# EAGLE design mainboard_v03 (EAGLE 6.3)

## Sheet 1 of 6
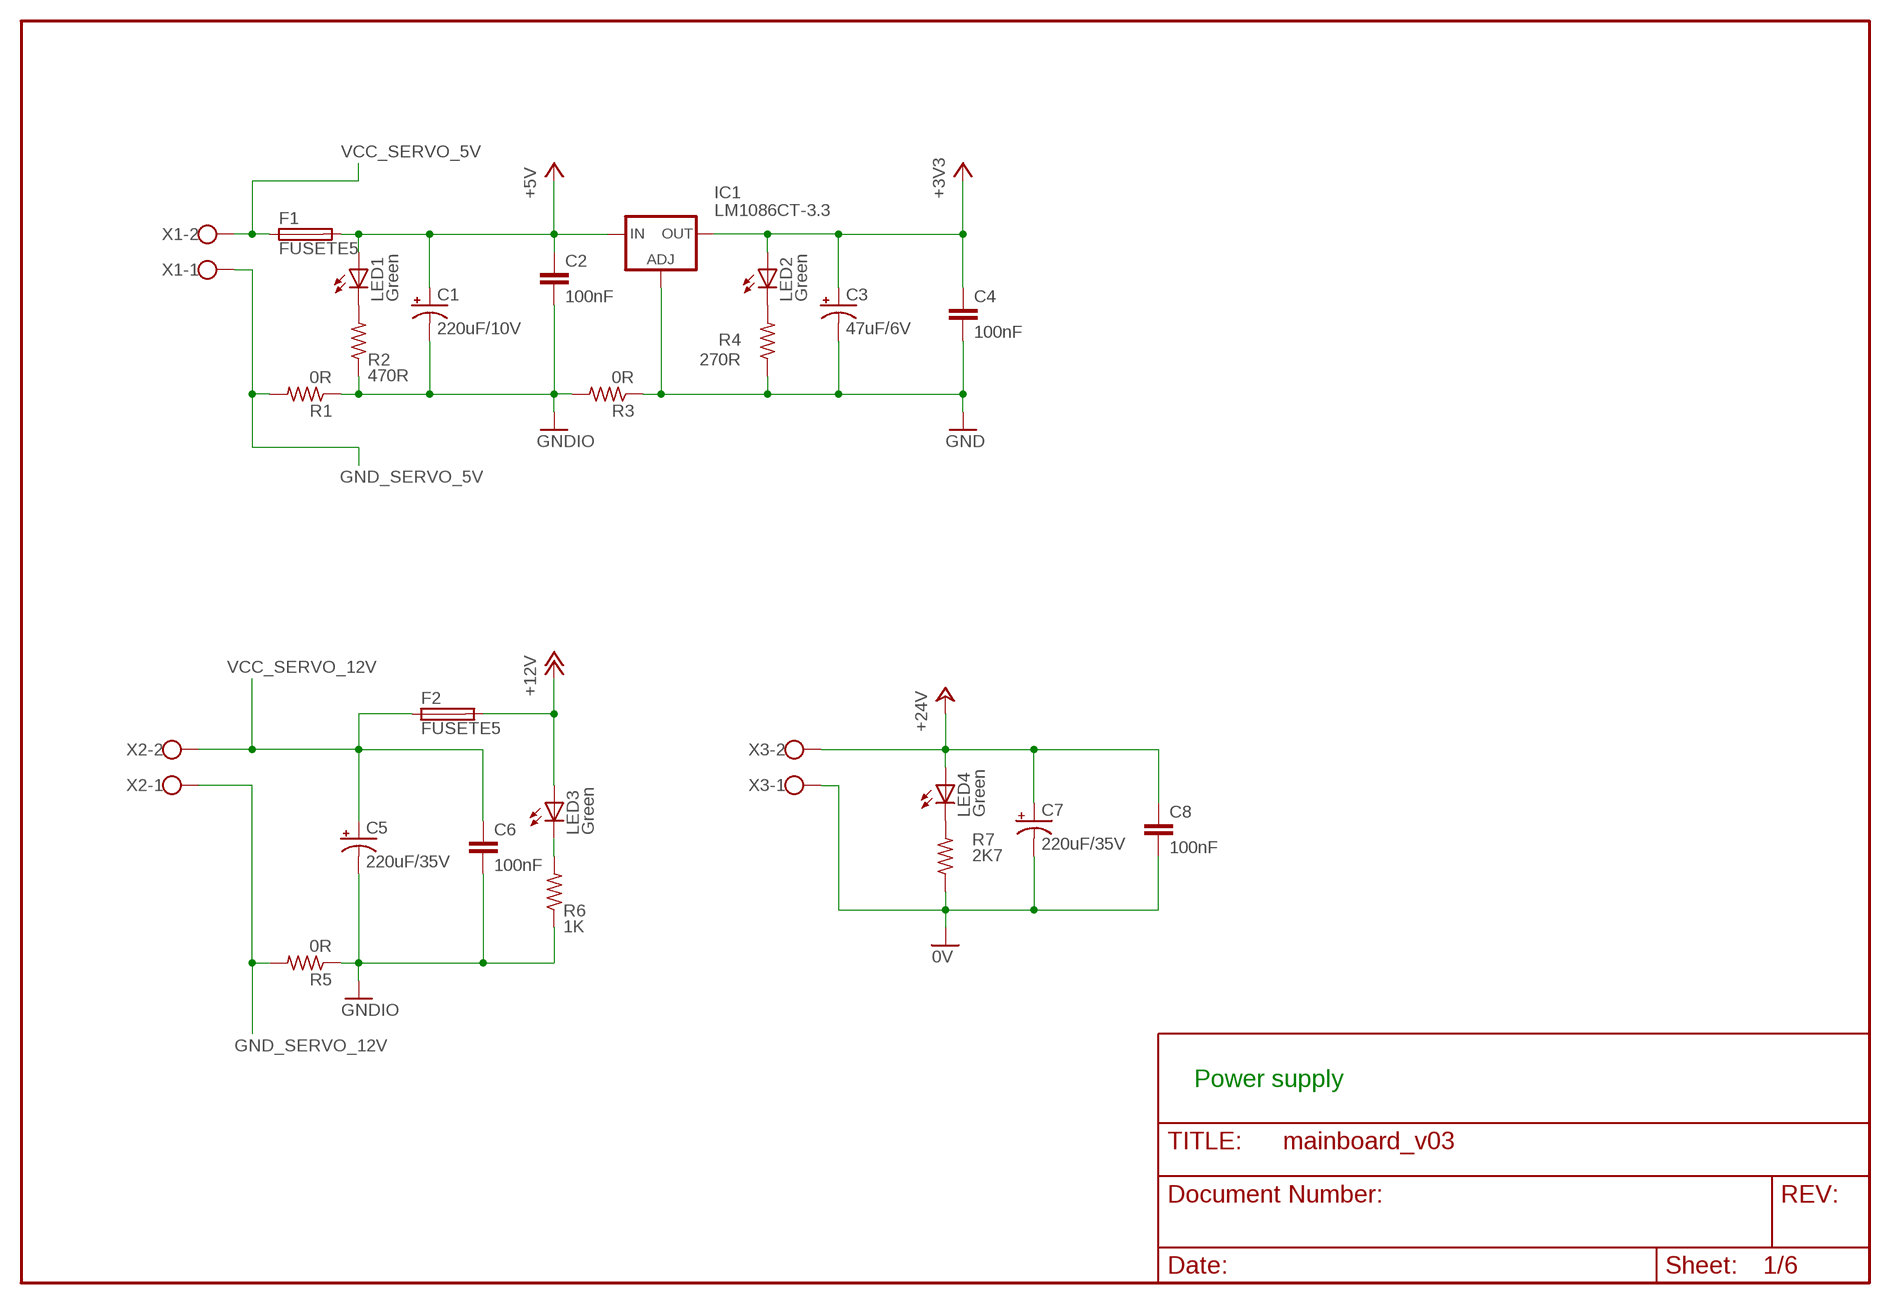
[diagram p0: schematic, sheet 1]

### Parts
C1  220uF/10V  CPOL-USE2.5-7  [E2,5-7]
C2  100nF  C-EUC0805  [C0805]
C3  47uF/6V  CPOL-USSMCD  [SMC_D]
C4  100nF  C-EUC0805  [C0805]
C5  220uF/35V  CPOL-USE5-10.5  [E5-10,5]
C6  100nF  C-EUC0805  [C0805]
C7  220uF/35V  CPOL-USE5-10.5  [E5-10,5]
C8  100nF  C-EUC0805  [C0805]
F1  FUSETE5  [TE5]
F2  FUSETE5  [TE5]
IC1  LM1086CT-3.3  LM317TS  [317TS]
LED1  Green  LEDCHIP-LED0805  [CHIP-LED0805]
LED2  Green  LEDCHIP-LED0805  [CHIP-LED0805]
LED3  Green  LEDCHIP-LED0805  [CHIP-LED0805]
LED4  Green  LEDCHIP-LED0805  [CHIP-LED0805]
R1  0R  R-US_R0805  [R0805]
R2  470R  R-US_R0805  [R0805]
R3  0R  R-US_R0805  [R0805]
R4  270R  R-US_R0805  [R0805]
R5  0R  R-US_R0805  [R0805]
R6  1K  R-US_R0805  [R0805]
R7  2K7  R-US_R0805  [R0805]
X1  W237-02P  [W237-132]
X2  W237-02P  [W237-132]
X3  W237-02P  [W237-132]

### Nets
0V: C7.- C8.2 R7.1 X3.1 ; also sheet 4
+3V3: C3.+ C4.1 IC1.2(OUT) LED2.A ; also sheet 2,5
+5V: C1.+ C2.1 F1.2 IC1.3(IN) LED1.A ; also sheet 2,3,6
+12V: F2.2 LED3.A ; also sheet 3,6
+24V: C7.+ C8.1 LED4.A X3.2 ; also sheet 4
GND: C3.- C4.2 IC1.1(ADJ) R3.1 R4.1 ; also sheet 2,4,5,6
GND_SERVO_5V: R1.2 X1.1 ; also sheet 3
GND_SERVO_12V: R5.2 X2.1 ; also sheet 3
GNDIO: C1.- C2.2 C5.- C6.2 R1.1 R2.1 R3.2 R5.1 R6.1 ; also sheet 3,6
N$64: LED1.C R2.2
N$65: LED2.C R4.2
N$66: LED3.C R6.2
N$67: LED4.C R7.2
VCC_SERVO_5V: F1.1 X1.2 ; also sheet 3
VCC_SERVO_12V: C5.+ C6.1 F2.1 X2.2 ; also sheet 3

### Notes on the sheet
- Power supply

## Sheet 2 of 6
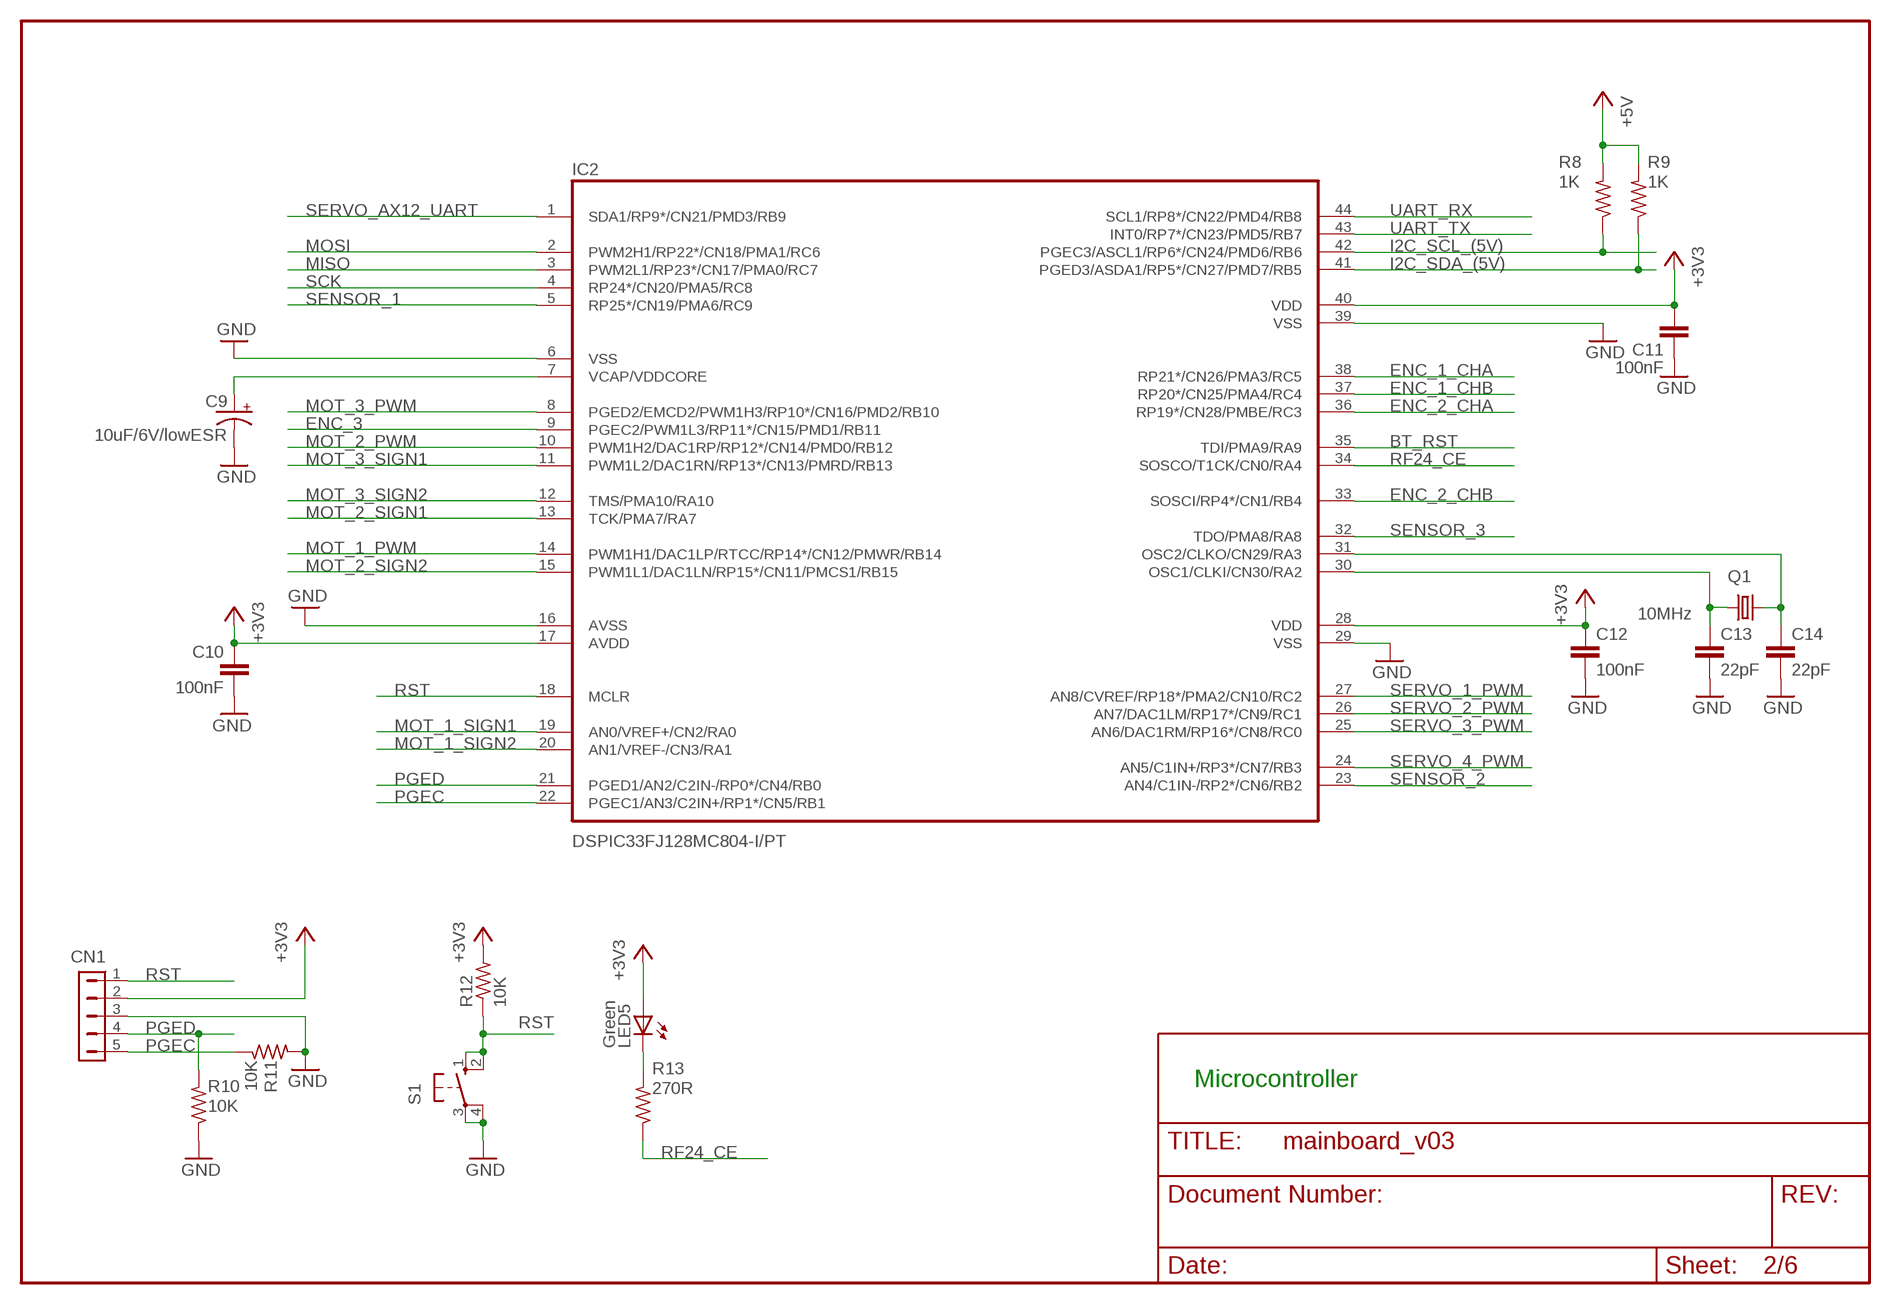
[diagram p1: schematic, sheet 2]

### Parts
C9  10uF/6V/lowESR  CPOL-USSMCA  [SMC_A]
C10  100nF  C-EUC0603  [C0603]
C11  100nF  C-EUC0603  [C0603]
C12  100nF  C-EUC0603  [C0603]
C13  22pF  C-EUC0805  [C0805]
C14  22pF  C-EUC0805  [C0805]
CN1  HDR-1X5-SIP-100  [SIP-100-5V]
IC2  DSPIC33FJ128MC804-I/PT  DSPIC33FJXXMC804SMD  [TQFP44]
LED5  Green  LEDCHIP-LED0805  [CHIP-LED0805]
Q1  10MHz  CRYSTALHC49UP  [HC49UP]
R8  1K  R-US_R0805  [R0805]
R9  1K  R-US_R0805  [R0805]
R10  10K  R-US_R0805  [R0805]
R11  10K  R-US_R0805  [R0805]
R12  10K  R-US_R0805  [R0805]
R13  270R  R-US_R0805  [R0805]
S1  10-XX  [B3F-10XX]

### Nets
+3V3: C10.1 C11.1 C12.1 CN1.2 IC2.17(AVDD) IC2.28(VDD) IC2.40(VDD) LED5.A R12.2 ; also sheet 1,5
+5V: R8.2 R9.2 ; also sheet 1,3,6
BT_RST: IC2.35(TDI/PMA9/RA9) ; also sheet 5
ENC_1_CHA: IC2.38(RP21*/CN26/PMA3/RC5) ; also sheet 3
ENC_1_CHB: IC2.37(RP20*/CN25/PMA4/RC4) ; also sheet 3
ENC_2_CHA: IC2.36(RP19*/CN28/PMBE/RC3) ; also sheet 3
ENC_2_CHB: IC2.33(SOSCI/RP4*/CN1/RB4) ; also sheet 3
ENC_3: IC2.9(PGEC2/PWM1L3/RP11*/CN15/PMD1/RB11) ; also sheet 3
GND: C9.- C10.2 C11.2 C12.2 C13.2 C14.2 CN1.3 IC2.6(VSS) IC2.16(AVSS) IC2.29(VSS) IC2.39(VSS) R10.1 R11.2 S1.3(P) S1.4(P1) ; also sheet 1,4,5,6
I2C_SCL_(5V): IC2.42(PGEC3/ASCL1/RP6*/CN24/PMD6/RB6) R8.1 ; also sheet 5,6
I2C_SDA_(5V): IC2.41(PGED3/ASDA1/RP5*/CN27/PMD7/RB5) R9.1 ; also sheet 5,6
MISO: IC2.3(PWM2L1/RP23*/CN17/PMA0/RC7) ; also sheet 5
MOSI: IC2.2(PWM2H1/RP22*/CN18/PMA1/RC6) ; also sheet 5
MOT_1_PWM: IC2.14(PWM1H1/DAC1LP/RTCC/RP14*/CN12/PMWR/RB14) ; also sheet 4
MOT_1_SIGN1: IC2.19(AN0/VREF+/CN2/RA0) ; also sheet 4
MOT_1_SIGN2: IC2.20(AN1/VREF-/CN3/RA1) ; also sheet 4
MOT_2_PWM: IC2.10(PWM1H2/DAC1RP/RP12*/CN14/PMD0/RB12) ; also sheet 4
MOT_2_SIGN1: IC2.13(TCK/PMA7/RA7) ; also sheet 4
MOT_2_SIGN2: IC2.15(PWM1L1/DAC1LN/RP15*/CN11/PMCS1/RB15) ; also sheet 4
MOT_3_PWM: IC2.8(PGED2/EMCD2/PWM1H3/RP10*/CN16/PMD2/RB10) ; also sheet 4
MOT_3_SIGN1: IC2.11(PWM1L2/DAC1RN/RP13*/CN13/PMRD/RB13) ; also sheet 4
MOT_3_SIGN2: IC2.12(TMS/PMA10/RA10) ; also sheet 4
N$8: LED5.C R13.2
N$47: C14.1 IC2.31(OSC2/CLKO/CN29/RA3) Q1.2
N$48: C13.1 IC2.30(OSC1/CLKI/CN30/RA2) Q1.1
N$49: C9.+ IC2.7(VCAP/VDDCORE)
PGEC: CN1.5 IC2.22(PGEC1/AN3/C2IN+/RP1*/CN5/RB1) R11.1
PGED: CN1.4 IC2.21(PGED1/AN2/C2IN-/RP0*/CN4/RB0) R10.2
RF24_CE: IC2.34(SOSCO/T1CK/CN0/RA4) R13.1 ; also sheet 5
RST: CN1.1 IC2.18(MCLR) R12.1 S1.1(S) S1.2(S1)
SCK: IC2.4(RP24*/CN20/PMA5/RC8) ; also sheet 5
SENSOR_1: IC2.5(RP25*/CN19/PMA6/RC9) ; also sheet 3
SENSOR_2: IC2.23(AN4/C1IN-/RP2*/CN6/RB2) ; also sheet 3
SENSOR_3: IC2.32(TDO/PMA8/RA8) ; also sheet 3
SERVO_1_PWM: IC2.27(AN8/CVREF/RP18*/PMA2/CN10/RC2) ; also sheet 3
SERVO_2_PWM: IC2.26(AN7/DAC1LM/RP17*/CN9/RC1) ; also sheet 3
SERVO_3_PWM: IC2.25(AN6/DAC1RM/RP16*/CN8/RC0) ; also sheet 3
SERVO_4_PWM: IC2.24(AN5/C1IN+/RP3*/CN7/RB3) ; also sheet 3
SERVO_AX12_UART: IC2.1(SDA1/RP9*/CN21/PMD3/RB9) ; also sheet 3
UART_RX: IC2.44(SCL1/RP8*/CN22/PMD4/RB8) ; also sheet 5
UART_TX: IC2.43(INT0/RP7*/CN23/PMD5/RB7) ; also sheet 5

### Notes on the sheet
- Microcontroller

## Sheet 3 of 6
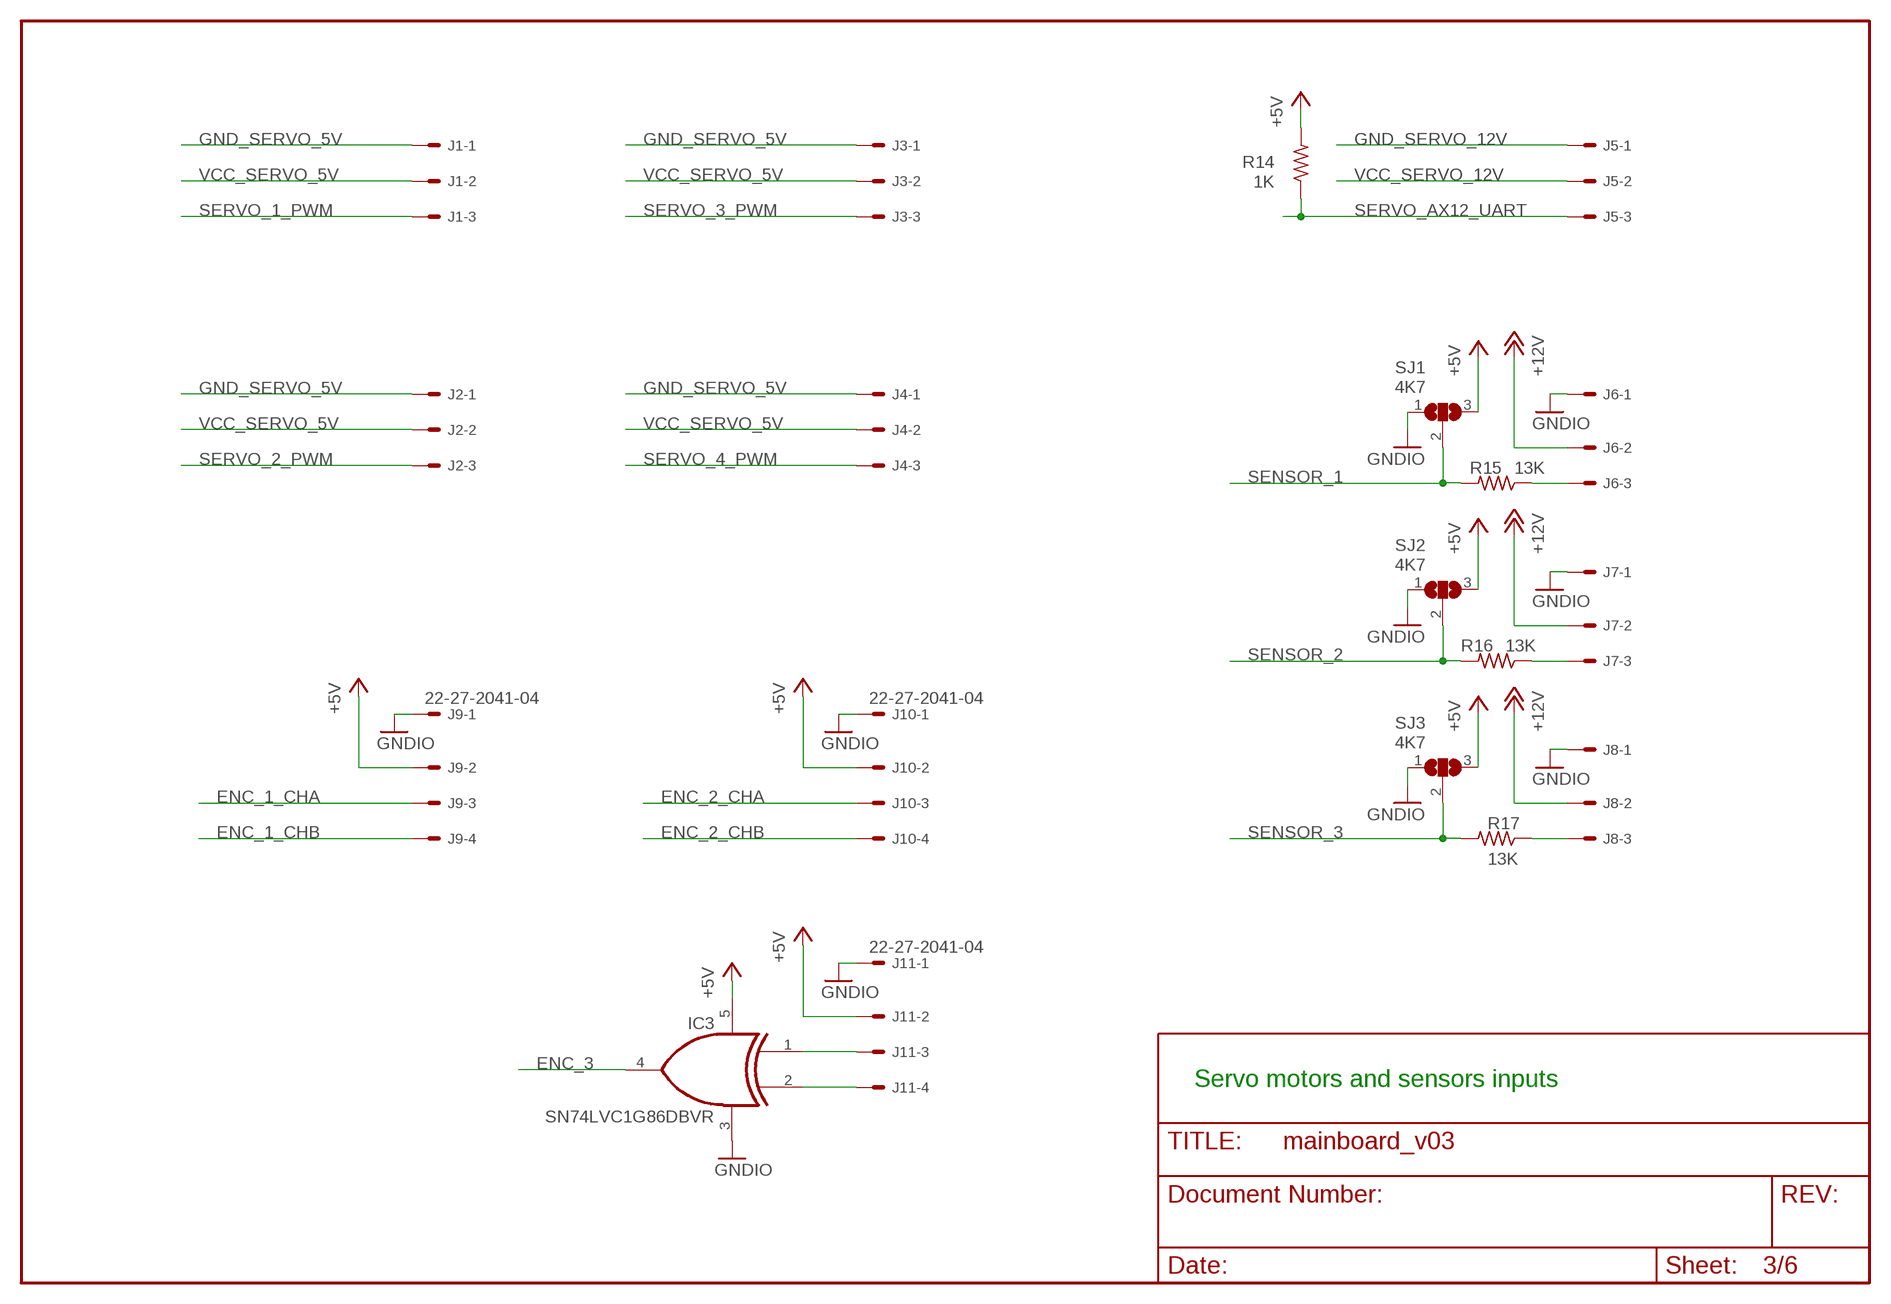
[diagram p2: schematic, sheet 3]

### Parts
IC3  SN74LVC1G86DBVR  74AHC1G86DBV  [SOT23-5]
J1  22-27-2031-03  [6410-03]
J2  22-27-2031-03  [6410-03]
J3  22-27-2031-03  [6410-03]
J4  22-27-2031-03  [6410-03]
J5  22-27-2031-03  [6410-03]
J6  22-27-2031-03  [6410-03]
J7  22-27-2031-03  [6410-03]
J8  22-27-2031-03  [6410-03]
J9  22-27-2041-04  [6410-04]
J10  22-27-2041-04  [6410-04]
J11  22-27-2041-04  [6410-04]
R14  1K  R-US_R0805  [R0805]
R15  13K  R-US_R0805  [R0805]
R16  13K  R-US_R0805  [R0805]
R17  13K  R-US_R0805  [R0805]
SJ1  4K7  SJ2W  [SJ_2]
SJ2  4K7  SJ2W  [SJ_2]
SJ3  4K7  SJ2W  [SJ_2]

### Nets
+5V: IC3.5(VCC) J9.2 J10.2 J11.2 R14.2 SJ1.3 SJ2.3 SJ3.3 ; also sheet 1,2,6
+12V: J6.2 J7.2 J8.2 ; also sheet 1,6
ENC_1_CHA: J9.3 ; also sheet 2
ENC_1_CHB: J9.4 ; also sheet 2
ENC_2_CHA: J10.3 ; also sheet 2
ENC_2_CHB: J10.4 ; also sheet 2
ENC_3: IC3.4(O) ; also sheet 2
GND_SERVO_5V: J1.1 J2.1 J3.1 J4.1 ; also sheet 1
GND_SERVO_12V: J5.1 ; also sheet 1
GNDIO: IC3.3(GND) J6.1 J7.1 J8.1 J9.1 J10.1 J11.1 SJ1.1 SJ2.1 SJ3.1 ; also sheet 1,6
N$3: J6.3 R15.1
N$10: IC3.1(I0) J11.3
N$11: IC3.2(I1) J11.4
N$13: J7.3 R16.1
N$50: J8.3 R17.1
SENSOR_1: R15.2 SJ1.2 ; also sheet 2
SENSOR_2: R16.2 SJ2.2 ; also sheet 2
SENSOR_3: R17.2 SJ3.2 ; also sheet 2
SERVO_1_PWM: J1.3 ; also sheet 2
SERVO_2_PWM: J2.3 ; also sheet 2
SERVO_3_PWM: J3.3 ; also sheet 2
SERVO_4_PWM: J4.3 ; also sheet 2
SERVO_AX12_UART: J5.3 R14.1 ; also sheet 2
VCC_SERVO_5V: J1.2 J2.2 J3.2 J4.2 ; also sheet 1
VCC_SERVO_12V: J5.2 ; also sheet 1

### Notes on the sheet
- Servo motors and sensors inputs

## Sheet 4 of 6
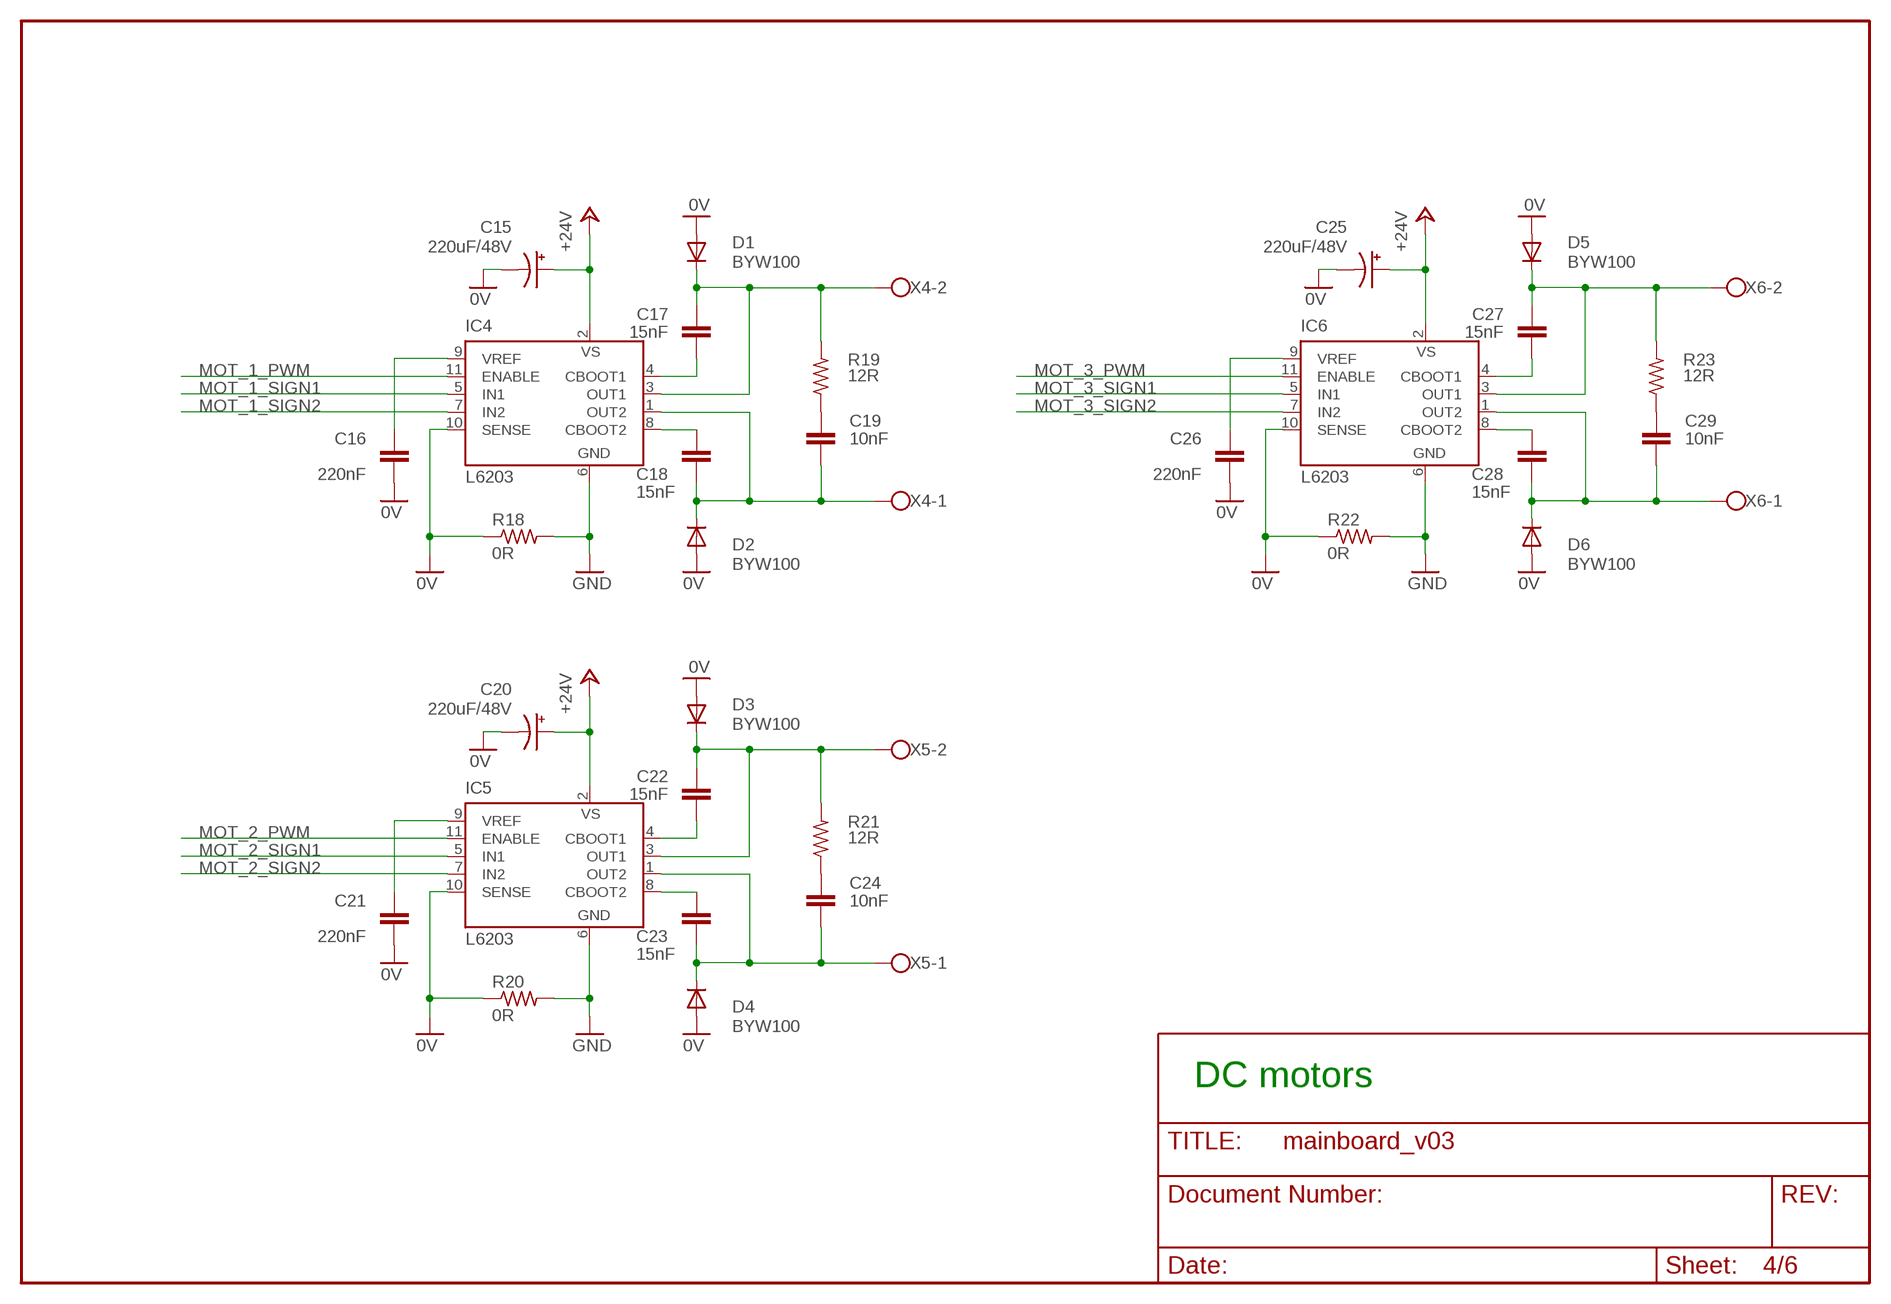
[diagram p3: schematic, sheet 4]

### Parts
C15  220uF/48V  CPOL-USE3.5-10  [E3,5-10]
C16  220nF  C-EUC0805  [C0805]
C17  15nF  C-EUC0805  [C0805]
C18  15nF  C-EUC0805  [C0805]
C19  10nF  C-EUC0805  [C0805]
C20  220uF/48V  CPOL-USE3.5-10  [E3,5-10]
C21  220nF  C-EUC0805  [C0805]
C22  15nF  C-EUC0805  [C0805]
C23  15nF  C-EUC0805  [C0805]
C24  10nF  C-EUC0805  [C0805]
C25  220uF/48V  CPOL-USE3.5-10  [E3,5-10]
C26  220nF  C-EUC0805  [C0805]
C27  15nF  C-EUC0805  [C0805]
C28  15nF  C-EUC0805  [C0805]
C29  10nF  C-EUC0805  [C0805]
D1  BYW100  [F126-10]
D2  BYW100  [F126-10]
D3  BYW100  [F126-10]
D4  BYW100  [F126-10]
D5  BYW100  [F126-10]
D6  BYW100  [F126-10]
IC4  L6203  [MULTIWATT-11]
IC5  L6203  [MULTIWATT-11]
IC6  L6203  [MULTIWATT-11]
R18  0R  R-US_M0805  [M0805]
R19  12R  R-US_M0805  [M0805]
R20  0R  R-US_M0805  [M0805]
R21  12R  R-US_M0805  [M0805]
R22  0R  R-US_M0805  [M0805]
R23  12R  R-US_M0805  [M0805]
X4  W237-02P  [W237-132]
X5  W237-02P  [W237-132]
X6  W237-02P  [W237-132]

### Nets
0V: C15.- C16.2 C20.- C21.2 C25.- C26.2 D1.A D2.A D3.A D4.A D5.A D6.A IC4.10(SENSE) IC5.10(SENSE) IC6.10(SENSE) R18.1 R20.1 R22.1 ; also sheet 1
+24V: C15.+ C20.+ C25.+ IC4.2(VS) IC5.2(VS) IC6.2(VS) ; also sheet 1
GND: IC4.6(GND) IC5.6(GND) IC6.6(GND) R18.2 R20.2 R22.2 ; also sheet 1,2,5,6
MOT_1_PWM: IC4.11(ENABLE) ; also sheet 2
MOT_1_SIGN1: IC4.5(IN1) ; also sheet 2
MOT_1_SIGN2: IC4.7(IN2) ; also sheet 2
MOT_2_PWM: IC5.11(ENABLE) ; also sheet 2
MOT_2_SIGN1: IC5.5(IN1) ; also sheet 2
MOT_2_SIGN2: IC5.7(IN2) ; also sheet 2
MOT_3_PWM: IC6.11(ENABLE) ; also sheet 2
MOT_3_SIGN1: IC6.5(IN1) ; also sheet 2
MOT_3_SIGN2: IC6.7(IN2) ; also sheet 2
N$1: C16.1 IC4.9(VREF)
N$12: C18.1 IC4.8(CBOOT2)
N$14: C17.1 IC4.4(CBOOT1)
N$15: C19.2 R19.1
N$21: C17.2 D1.C IC4.3(OUT1) R19.2 X4.2
N$22: C18.2 C19.1 D2.C IC4.1(OUT2) X4.1
N$29: C21.1 IC5.9(VREF)
N$36: C26.1 IC6.9(VREF)
N$37: C28.1 IC6.8(CBOOT2)
N$38: C27.1 IC6.4(CBOOT1)
N$39: C23.1 IC5.8(CBOOT2)
N$40: C29.2 R23.1
N$41: C22.1 IC5.4(CBOOT1)
N$42: C24.2 R21.1
N$43: C22.2 D3.C IC5.3(OUT1) R21.2 X5.2
N$44: C23.2 C24.1 D4.C IC5.1(OUT2) X5.1
N$45: C27.2 D5.C IC6.3(OUT1) R23.2 X6.2
N$46: C28.2 C29.1 D6.C IC6.1(OUT2) X6.1

### Notes on the sheet
- DC motors

## Sheet 5 of 6
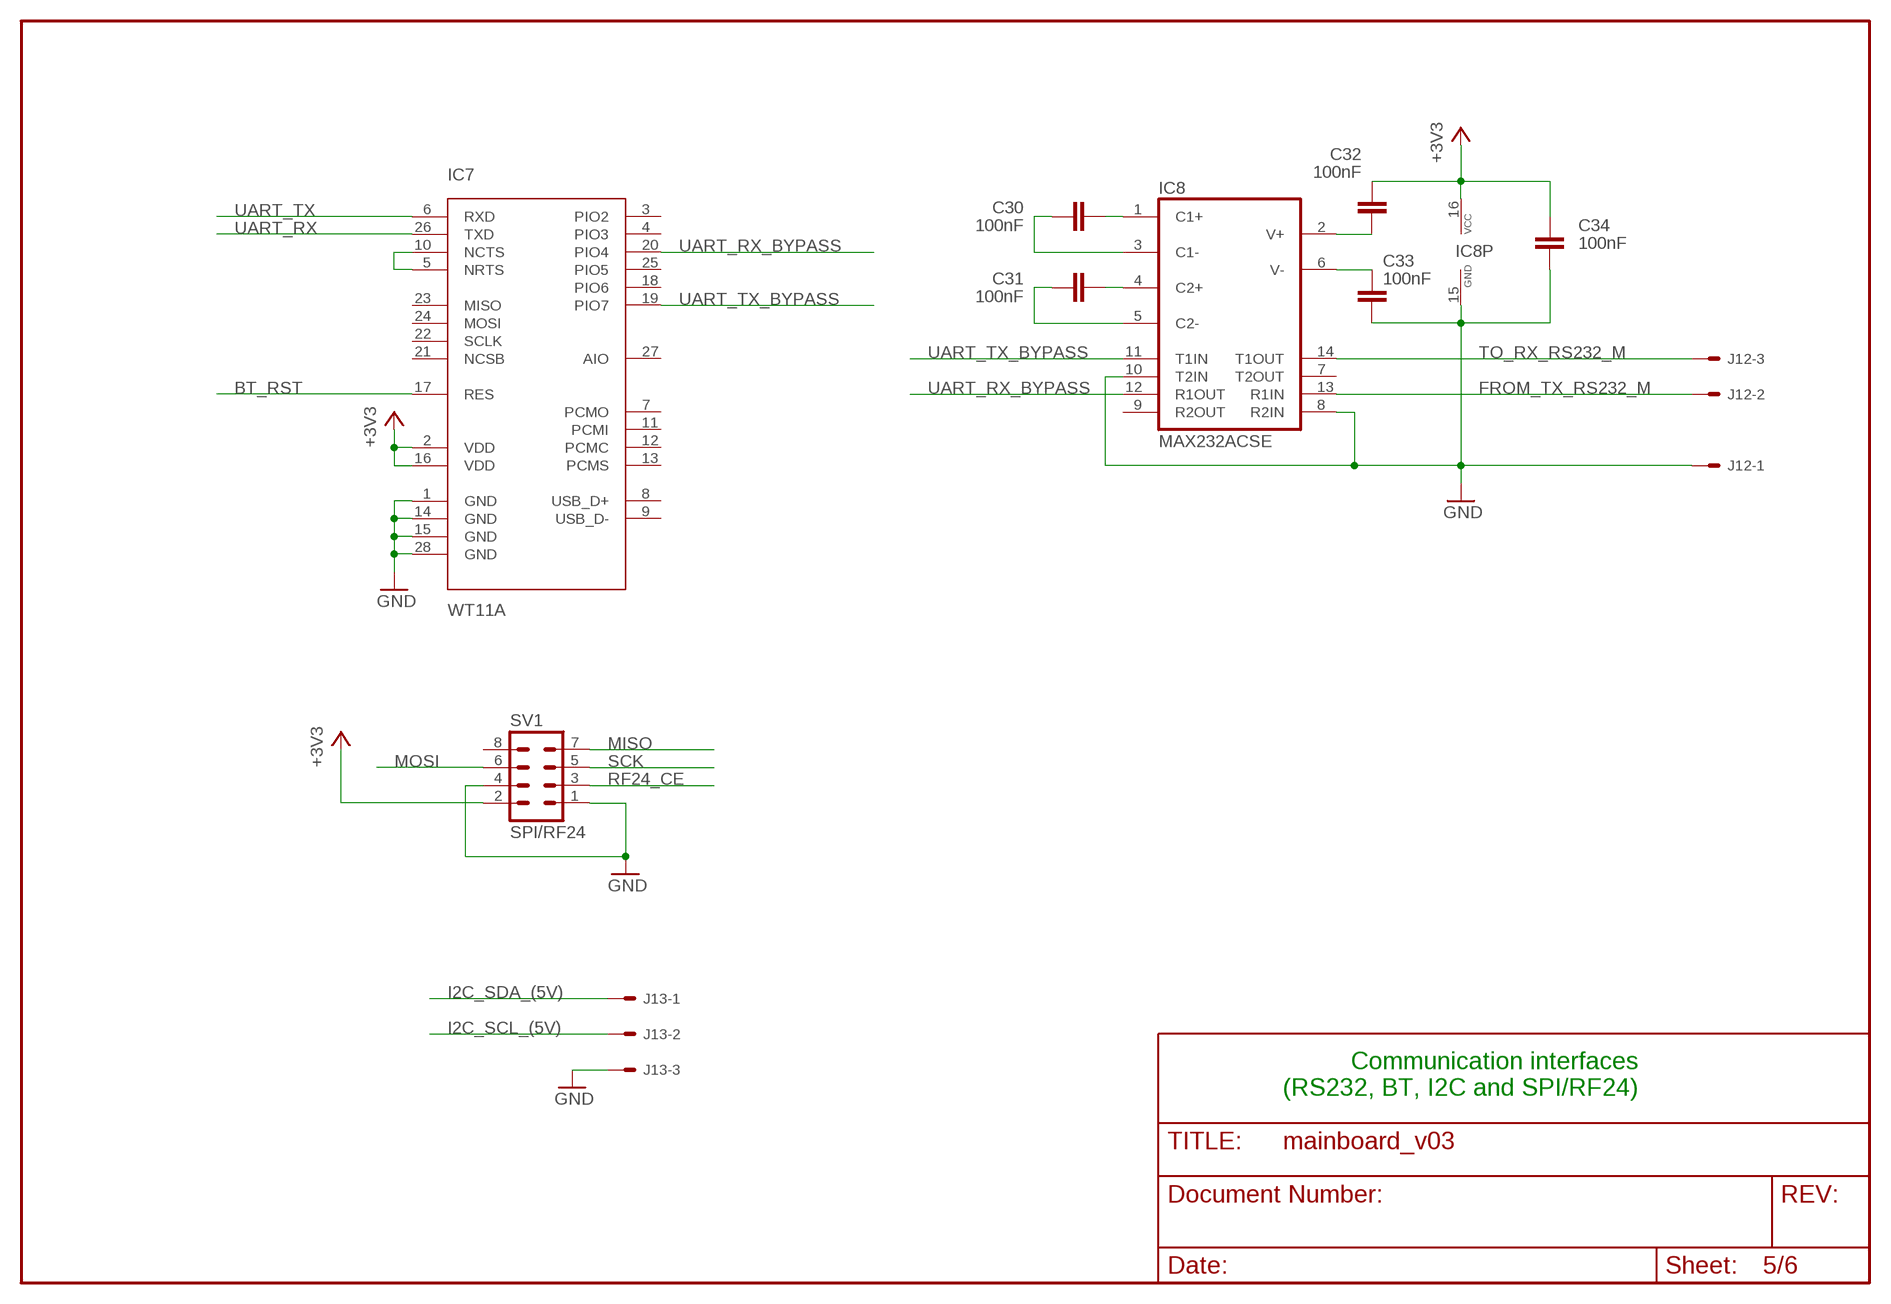
[diagram p4: schematic, sheet 5]

### Parts
C30  100nF  C-EUC0603  [C0603]
C31  100nF  C-EUC0603  [C0603]
C32  100nF  C-EUC0603  [C0603]
C33  100nF  C-EUC0603  [C0603]
C34  100nF  C-EUC0603  [C0603]
IC7  WT11A  [WT11]
IC8  MAX232ACSE  [SO16]
J12  22-27-2031-03  [6410-03]
J13  22-27-2031-03  [6410-03]
SV1  SPI/RF24  MA04-2  [MA04-2]

### Nets
+3V3: C32.2 C34.2 IC7.2(VDD) IC7.16(VDD) IC8.16(VCC) SV1.2 ; also sheet 1,2
BT_RST: IC7.17(RES) ; also sheet 2
FROM_TX_RS232_M: IC8.13(R1IN) J12.2
GND: C33.1 C34.1 IC7.1(GND) IC7.14(GND) IC7.15(GND) IC7.28(GND) IC8.8(R2IN) IC8.10(T2IN) IC8.15(GND) J12.1 J13.3 SV1.1 SV1.4 ; also sheet 1,2,4,6
I2C_SCL_(5V): J13.2 ; also sheet 2,6
I2C_SDA_(5V): J13.1 ; also sheet 2,6
MISO: SV1.7 ; also sheet 2
MOSI: SV1.6 ; also sheet 2
N$16: IC7.5(NRTS) IC7.10(NCTS)
N$27: C30.2 IC8.1(C1+)
N$30: C30.1 IC8.3(C1-)
N$31: C31.2 IC8.4(C2+)
N$32: C31.1 IC8.5(C2-)
N$33: C32.1 IC8.2(V+)
N$34: C33.2 IC8.6(V-)
RF24_CE: SV1.3 ; also sheet 2
SCK: SV1.5 ; also sheet 2
TO_RX_RS232_M: IC8.14(T1OUT) J12.3
UART_RX: IC7.26(TXD) ; also sheet 2
UART_RX_BYPASS: IC7.20(PIO4) IC8.12(R1OUT)
UART_TX: IC7.6(RXD) ; also sheet 2
UART_TX_BYPASS: IC7.19(PIO7) IC8.11(T1IN)
Unconnected: IC7.3(PIO2) IC7.4(PIO3) IC7.7(PCMO) IC7.8(USB_D+) IC7.9(USB_D-) IC7.11(PCMI) IC7.12(PCMC) IC7.13(PCMS) IC7.18(PIO6) IC7.21(NCSB) IC7.22(SCLK) IC7.23(MISO) IC7.24(MOSI) IC7.25(PIO5) IC7.27(AIO) IC8.7(T2OUT) IC8.9(R2OUT) SV1.8

### Notes on the sheet
- Communication interfaces
  (RS232, BT, I2C and SPI/RF24)

## Sheet 6 of 6
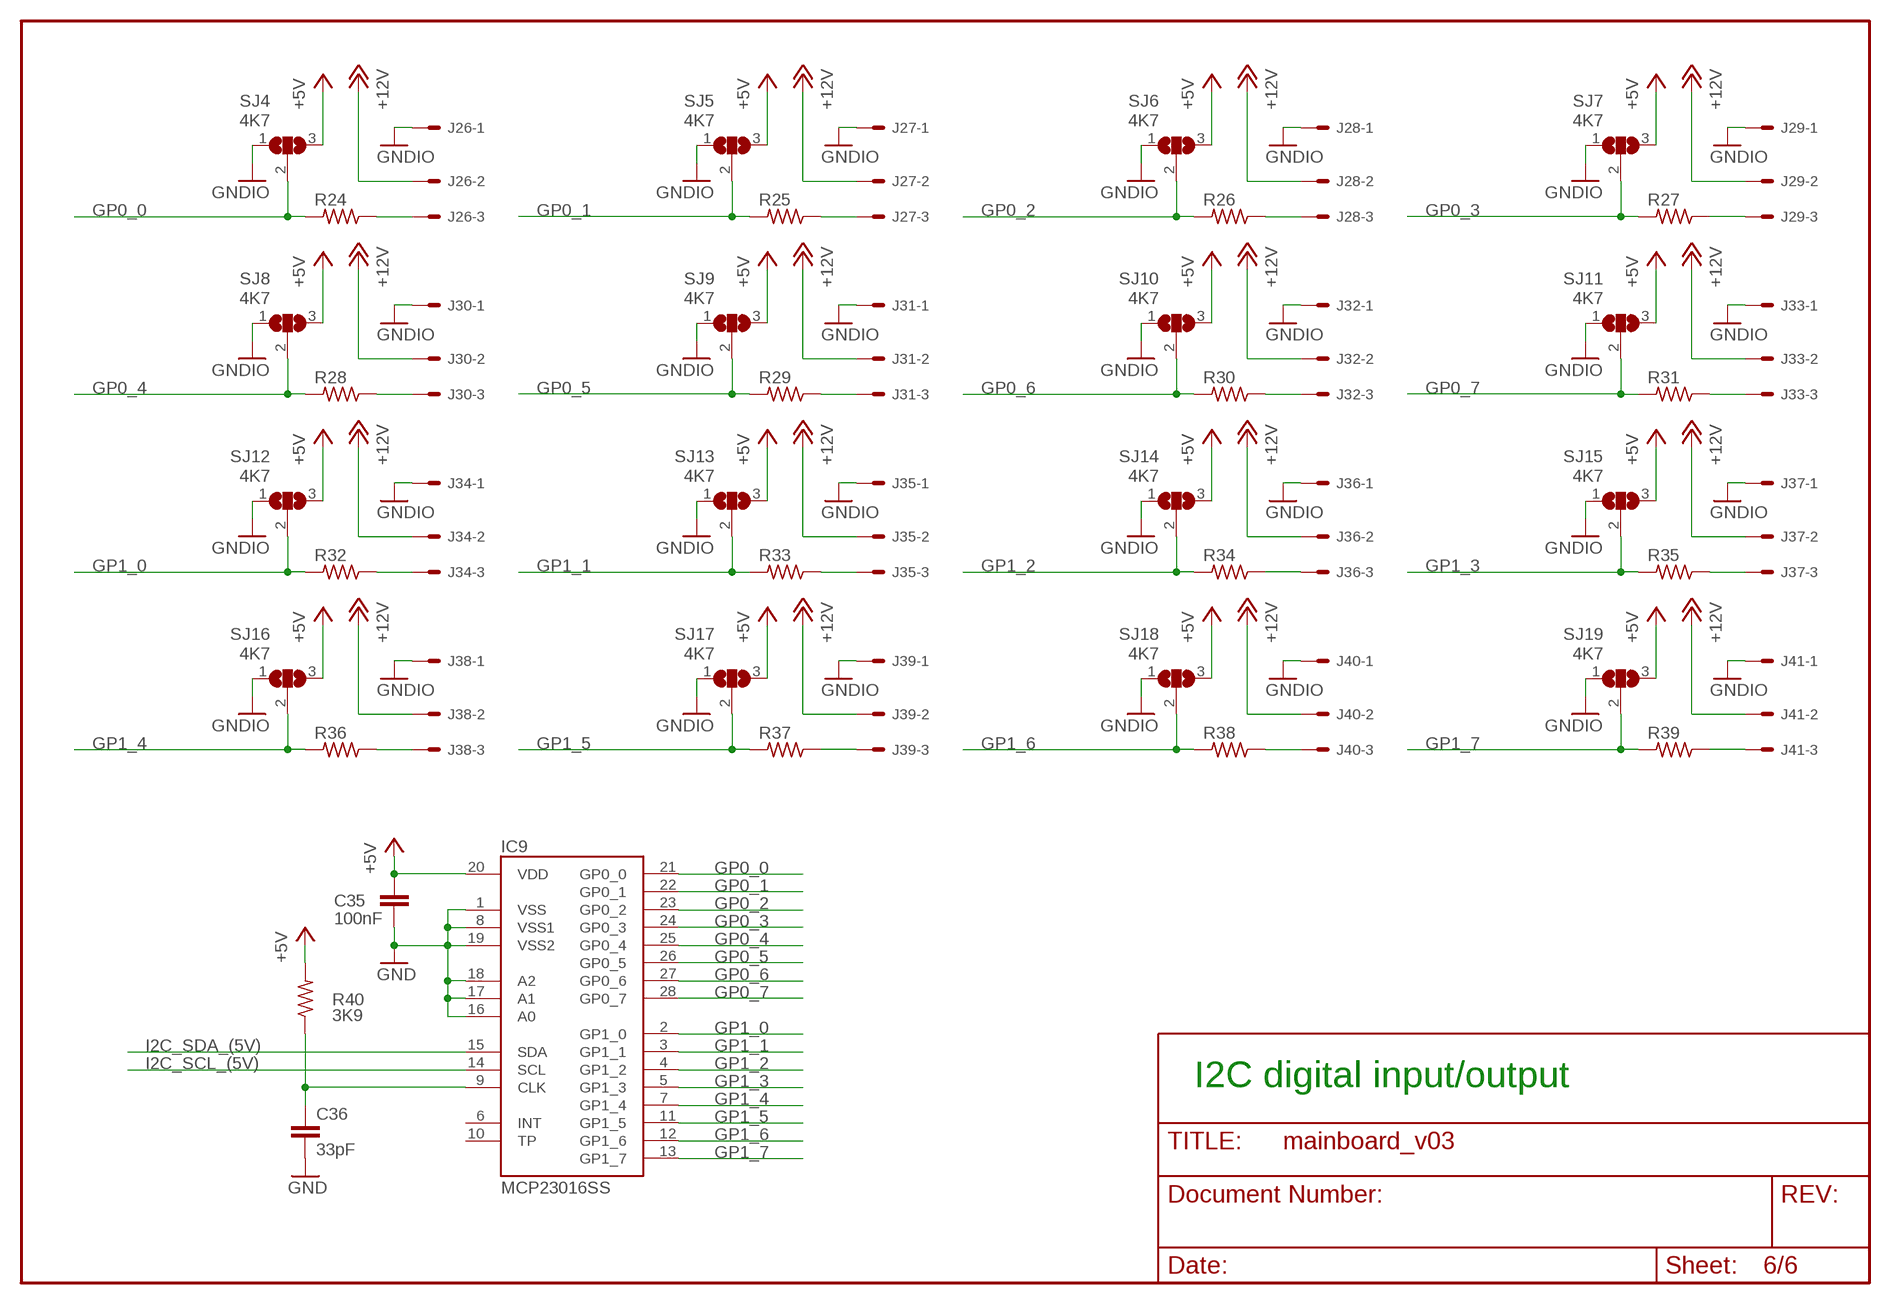
[diagram p5: schematic, sheet 6]

### Parts
C35  100nF  C-EUC0805  [C0805]
C36  33pF  C-EUC0805  [C0805]
IC9  MCP23016SS  [SSOP28]
J26  22-27-2031-03  [6410-03]
J27  22-27-2031-03  [6410-03]
J28  22-27-2031-03  [6410-03]
J29  22-27-2031-03  [6410-03]
J30  22-27-2031-03  [6410-03]
J31  22-27-2031-03  [6410-03]
J32  22-27-2031-03  [6410-03]
J33  22-27-2031-03  [6410-03]
J34  22-27-2031-03  [6410-03]
J35  22-27-2031-03  [6410-03]
J36  22-27-2031-03  [6410-03]
J37  22-27-2031-03  [6410-03]
J38  22-27-2031-03  [6410-03]
J39  22-27-2031-03  [6410-03]
J40  22-27-2031-03  [6410-03]
J41  22-27-2031-03  [6410-03]
R24  R-US_R0805  [R0805]
R25  R-US_R0805  [R0805]
R26  R-US_R0805  [R0805]
R27  R-US_R0805  [R0805]
R28  R-US_R0805  [R0805]
R29  R-US_R0805  [R0805]
R30  R-US_R0805  [R0805]
R31  R-US_R0805  [R0805]
R32  R-US_R0805  [R0805]
R33  R-US_R0805  [R0805]
R34  R-US_R0805  [R0805]
R35  R-US_R0805  [R0805]
R36  R-US_R0805  [R0805]
R37  R-US_R0805  [R0805]
R38  R-US_R0805  [R0805]
R39  R-US_R0805  [R0805]
R40  3K9  R-US_R0805  [R0805]
SJ4  4K7  SJ2W  [SJ_2]
SJ5  4K7  SJ2W  [SJ_2]
SJ6  4K7  SJ2W  [SJ_2]
SJ7  4K7  SJ2W  [SJ_2]
SJ8  4K7  SJ2W  [SJ_2]
SJ9  4K7  SJ2W  [SJ_2]
SJ10  4K7  SJ2W  [SJ_2]
SJ11  4K7  SJ2W  [SJ_2]
SJ12  4K7  SJ2W  [SJ_2]
SJ13  4K7  SJ2W  [SJ_2]
SJ14  4K7  SJ2W  [SJ_2]
SJ15  4K7  SJ2W  [SJ_2]
SJ16  4K7  SJ2W  [SJ_2]
SJ17  4K7  SJ2W  [SJ_2]
SJ18  4K7  SJ2W  [SJ_2]
SJ19  4K7  SJ2W  [SJ_2]

### Nets
+5V: C35.1 IC9.20(VDD) R40.2 SJ4.3 SJ5.3 SJ6.3 SJ7.3 SJ8.3 SJ9.3 SJ10.3 SJ11.3 SJ12.3 SJ13.3 SJ14.3 SJ15.3 SJ16.3 SJ17.3 SJ18.3 SJ19.3 ; also sheet 1,2,3
+12V: J26.2 J27.2 J28.2 J29.2 J30.2 J31.2 J32.2 J33.2 J34.2 J35.2 J36.2 J37.2 J38.2 J39.2 J40.2 J41.2 ; also sheet 1,3
GND: C35.2 C36.2 IC9.1(VSS) IC9.8(VSS1) IC9.16(A0) IC9.17(A1) IC9.18(A2) IC9.19(VSS2) ; also sheet 1,2,4,5
GNDIO: J26.1 J27.1 J28.1 J29.1 J30.1 J31.1 J32.1 J33.1 J34.1 J35.1 J36.1 J37.1 J38.1 J39.1 J40.1 J41.1 SJ4.1 SJ5.1 SJ6.1 SJ7.1 SJ8.1 SJ9.1 SJ10.1 SJ11.1 SJ12.1 SJ13.1 SJ14.1 SJ15.1 SJ16.1 SJ17.1 SJ18.1 SJ19.1 ; also sheet 1,3
GP0_0: IC9.21(GP0_0) R24.2 SJ4.2
GP0_1: IC9.22(GP0_1) R25.2 SJ5.2
GP0_2: IC9.23(GP0_2) R26.2 SJ6.2
GP0_3: IC9.24(GP0_3) R27.2 SJ7.2
GP0_4: IC9.25(GP0_4) R28.2 SJ8.2
GP0_5: IC9.26(GP0_5) R29.2 SJ9.2
GP0_6: IC9.27(GP0_6) R30.2 SJ10.2
GP0_7: IC9.28(GP0_7) R31.2 SJ11.2
GP1_0: IC9.2(GP1_0) R32.2 SJ12.2
GP1_1: IC9.3(GP1_1) R33.2 SJ13.2
GP1_2: IC9.4(GP1_2) R34.2 SJ14.2
GP1_3: IC9.5(GP1_3) R35.2 SJ15.2
GP1_4: IC9.7(GP1_4) R36.2 SJ16.2
GP1_5: IC9.11(GP1_5) R37.2 SJ17.2
GP1_6: IC9.12(GP1_6) R38.2 SJ18.2
GP1_7: IC9.13(GP1_7) R39.2 SJ19.2
I2C_SCL_(5V): IC9.14(SCL) ; also sheet 2,5
I2C_SDA_(5V): IC9.15(SDA) ; also sheet 2,5
N$2: J26.3 R24.1
N$4: J30.3 R28.1
N$5: J27.3 R25.1
N$6: J31.3 R29.1
N$7: J34.3 R32.1
N$9: J38.3 R36.1
N$17: J35.3 R33.1
N$18: J39.3 R37.1
N$19: J40.3 R38.1
N$20: J36.3 R34.1
N$23: J37.3 R35.1
N$24: J41.3 R39.1
N$25: J32.3 R30.1
N$26: J33.3 R31.1
N$28: J29.3 R27.1
N$35: J28.3 R26.1
N$63: C36.1 IC9.9(CLK) R40.1
Unconnected: IC9.6(INT) IC9.10(TP)

### Notes on the sheet
- I2C digital input/output

## Library data of the parts
C1 C3 C5 C7 C9 C15 C20 C25 = rcl:CPOL-US: POLARIZED CAPACITOR, American symbol
C2 C4 C6 C8 C10-C14 C16-C19 C21-C24 C26-C36 = rcl:C-EU: CAPACITOR, European symbol
CN1 = con-hdrs40:HDR-1X5: HEADER CONNECTOR
D1-D6 = diode:BYW100: DIODE high-efficiency fast rectifier (ST)
F1 F2 = fuse:FUSE: Fuse
IC1 = v-reg:LM317TS: VOLTAGE REGULATOR
IC2 = eagle_jbs_lib:DSPIC33FJXXMC804
IC3 = Robots:74*1G86: 2-input EXCLUSIV-OR gate
IC4-IC6 = st-microelectronics:L6203: DMOS FULL BRIDGE DRIVER
IC7 = eagle_jbs_lib:WT11
IC8 = maxim-10:MAX232*: RS232 TRANSEIVER
IC9 = Robots:MCP23016
J1-J8 J12 J13 J26-J41 = con-molex:22-?-03: CONNECTOR wire to board 2.54 mm (.1 inch) pitch header
J9-J11 = con-molex:22-?-04: CONNECTOR wire to board 2.54 mm (.1 inch) pitch header
LED1-LED5 = led:LED: LED OSRAM: - CHIPLED LG R971, LG N971, LY N971, LG Q971, LY Q971, LO R971, LY R971 LH N974, LH R974 LS Q976, LO Q976, LY Q976 LO Q996 - Hyper CHIPLED LW Q18S LB Q993, LB Q99A, LB R99A - SideLED LS A670, LO A670, LY A670, LG A670, LP A670 LB A673, LV A673, LT A673, LW A673 LH A674 LY A675 LS A676, LA A676, LO A676, LY A676, LW A676 LS A679, LY A679, LG A679 - Hyper Micro SIDELED® LS Y876, LA Y876, LO Y876, LY Y876 LT Y87S - SmartLED LW L88C, LW L88S LB L89C, LB L89S, LG L890 LS L89K, LO L89K, LY L89K LS L896, LA L896, LO L896, LY L896 - TOPLED LS T670, LO T670, LY T670, LG T670, LP T670 LSG T670, LSP T670, LSY T670, LOP T670, LYG T670 LG T671, LOG T671, LSG T671 LB T673, LV T673, LT T673, LW T673 LH T674 LS T676, LA T676, LO T676, LY T676, LB T676, LH T676, LSB T676, LW T676 LB T67C, LV T67C, LT T67C, LS T67K, LO T67K, LY T67K, LW E67C LS E67B, LA E67B, LO E67B, LY E67B, LB E67C, LV E67C, LT E67C LW T67C LS T679, LY T679, LG T679 LS T770, LO T770, LY T770, LG T770, LP T770 LB T773, LV T773, LT T773, LW T773 LH T774 LS E675, LA E675, LY E675, LS T675 LS T776, LA T776, LO T776, LY T776, LB T776 LHGB T686 LT T68C, LB T68C - Hyper Mini TOPLED® LB M676 - Mini TOPLED Santana® LG M470 LS M47K, LO M47K, LY M47K Source: http://www.osram.convergy.de - LUMILED® LXK2-PW12-R00, LXK2-PW12-S00, LXK2-PW14-U00, LXK2-PW14-V00 LXK2-PM12-R00, LXK2-PM12-S00, LXK2-PM14-U00 LXK2-PE12-Q00, LXK2-PE12-R00, LXK2-PE12-S00, LXK2-PE14-T00, LXK2-PE14-U00 LXK2-PB12-K00, LXK2-PB12-L00, LXK2-PB12-M00, LXK2-PB14-N00, LXK2-PB14-P00, LXK2-PB14-Q00 LXK2-PR12-L00, LXK2-PR12-M00, LXK2-PR14-Q00, LXK2-PR14-R00 LXK2-PD12-Q00, LXK2-PD12-R00, LXK2-PD12-S00 LXK2-PH12-R00, LXK2-PH12-S00 LXK2-PL12-P00, LXK2-PL12-Q00, LXK2-PL12-R00 Source: www.luxeon.com
Q1 = crystal:CRYSTAL: CRYSTAL
R1-R40 = rcl:R-US_: RESISTOR, American symbol
S1 = switch-omron:10-XX: OMRON SWITCH
SJ1-SJ19 = jumper:SJ2W: SMD solder JUMPER
SV1 = con-lstb:MA04-2: PIN HEADER; OC_FARNELL: unknown; OC_NEWARK: unknown
X1-X6 = con-wago-508:W237-02P: WAGO SREW CLAMP

## Board
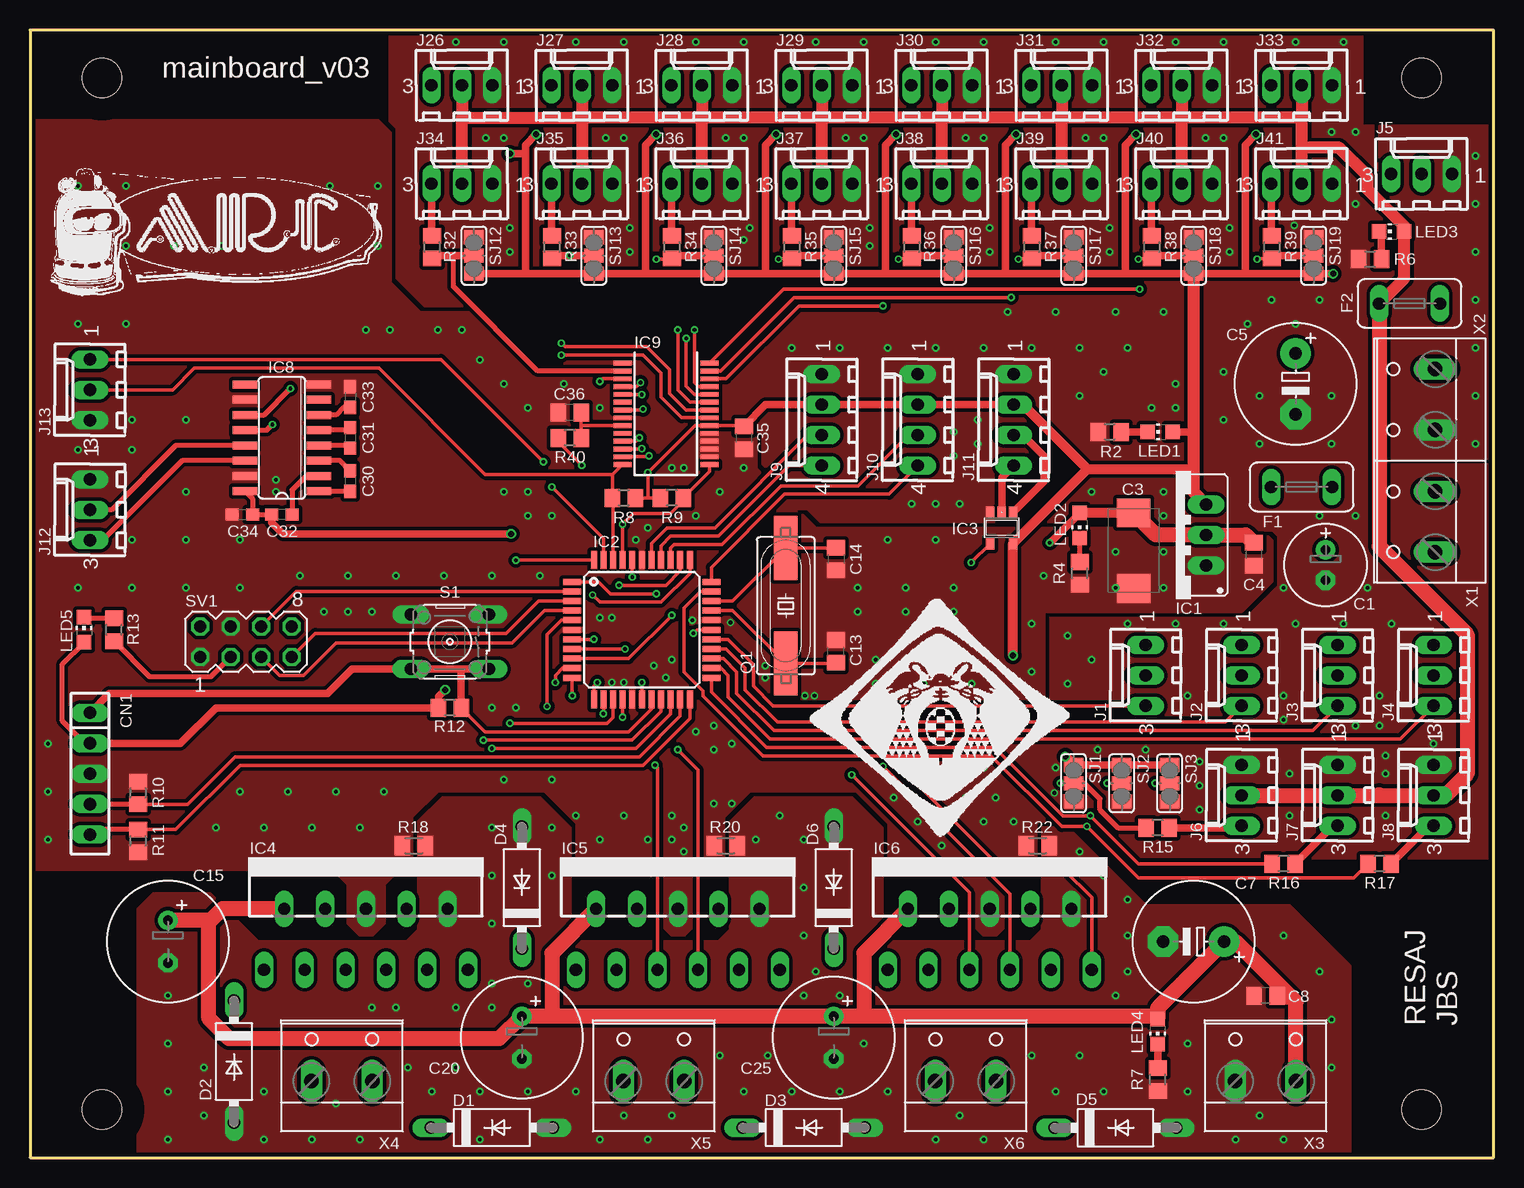
[diagram p6: board, top side]
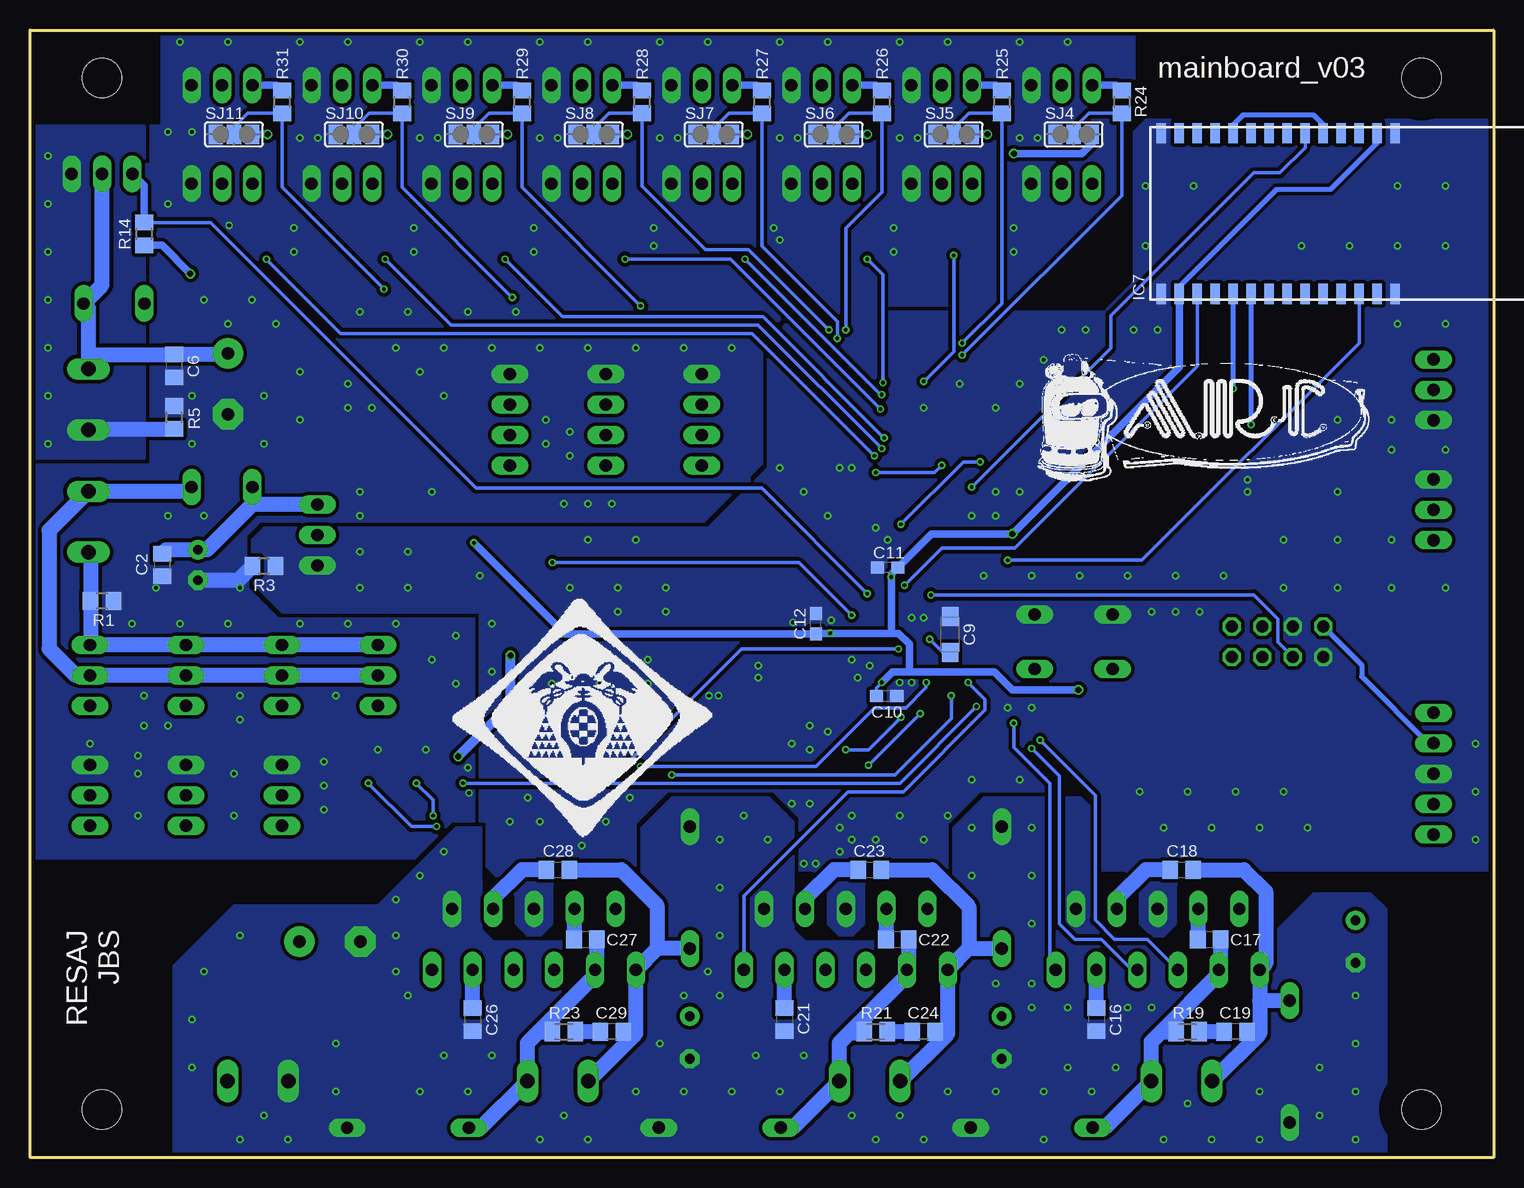
[diagram p7: board, bottom side, seen from below]

Size 122 x 94 mm. Coordinates in mm from the lower left corner, seen from the top.
Outline: 0,0 122,0 122,94 0,94 0,0
Copper layers (1*16): Top 0.035mm / dielectric 1.5mm / Bottom 0.035mm
Design rules "ITEADstudio_DRC": minimum track width 6mil, minimum drill 12mil, track to track 6mil, track to pad 6mil, pad to pad 6mil, via to via 6mil, smd to smd 0mil, copper to edge 10mil, drill to drill 10mil, minimum pad ring 10mil, minimum via ring 6mil, stop-mask expansion 2mil, vias tented up to drill 100mil, thermal gap 10mil
Holes 3.3 mm at 6,4 116,4 6,90 116,90
tRestrict: area 3,1 to 9,7; area 3,87 to 9,93; area 113,1 to 119,7; area 113,87 to 119,93
bRestrict: area 3,87 to 9,93; area 3,1 to 9,7; area 113,1 to 119,7; area 113,87 to 119,93

### Footprints (pad centres in the part's own frame; a part is rotated, then mirrored left to right if it is on the bottom)
E2,5-7 = drill 0.813 pad 1.6: + -1.27,0 | drill 0.813 pad 1.6 octagon: - 1.27,0
C0805 = smd 1.3 x 1.5: 1 -0.95,0; 2 0.95,0
SMC_D = smd 2.4 x 2.8: + -3.15,0; - 3.15,0
E5-10,5 = drill 1.016 pad 2.54: + -2.54,0 | drill 1.016 pad 2.54 octagon: - 2.54,0
SMC_A = smd 1.6 x 1.4: + -1.5,0; - 1.5,0
C0603 = smd 1.1 x 1: 1 -0.85,0; 2 0.85,0
E3,5-10 = drill 0.813 pad 1.6: + -1.778,0 | drill 0.813 pad 1.6 octagon: - 1.778,0
SIP-100-5V = drill 1.016 long: 1 -5.08,0; 2 -2.54,0; 3 0,0; 4 2.54,0; 5 5.08,0
F126-10 = drill 1.016 long: A 5.08,0; C -5.08,0
TE5 = drill 1.016 long: 1 -2.54,0; 2 2.54,0
317TS = drill 1.016 long: 1 -2.54,-2.54; 2 0,-2.54; 3 2.54,-2.54
TQFP44 = smd 1.5 x 0.5: 1 -5.8,4; 2 -5.8,3.2; 3 -5.8,2.4; 4 -5.8,1.6; 5 -5.8,0.8; 6 -5.8,0; 7 -5.8,-0.8; 8 -5.8,-1.6; 9 -5.8,-2.4; 10 -5.8,-3.2; 11 -5.8,-4; 23 5.8,-4; 24 5.8,-3.2; 25 5.8,-2.4; 26 5.8,-1.6; 27 5.8,-0.8; 28 5.8,0; 29 5.8,0.8; 30 5.8,1.6; 31 5.8,2.4; 32 5.8,3.2; 33 5.8,4 | smd 0.5 x 1.5: 12 -4,-5.8; 13 -3.2,-5.8; 14 -2.4,-5.8; 15 -1.6,-5.8; 16 -0.8,-5.8; 17 0,-5.8; 18 0.8,-5.8; 19 1.6,-5.8; 20 2.4,-5.8; 21 3.2,-5.8; 22 4,-5.8; 34 4,5.8; 35 3.2,5.8; 36 2.4,5.8; 37 1.6,5.8; 38 0.8,5.8; 39 0,5.8; 40 -0.8,5.8; 41 -1.6,5.8; 42 -2.4,5.8; 43 -3.2,5.8; 44 -4,5.8
SOT23-5 = smd 0.69 x 0.99: 1 -0.95,-1.29; 2 0,-1.29; 3 0.95,-1.29; 4 0.95,1.3; 5 -0.95,1.3
MULTIWATT-11 = drill 1.016 long: 1 -8.5,-6.35; 2 -6.8,-1.27; 3 -5.1,-6.35; 4 -3.4,-1.27; 5 -1.7,-6.35; 6 0,-1.27; 7 1.7,-6.35; 8 3.4,-1.27; 9 5.1,-6.35; 10 6.8,-1.27; 11 8.5,-6.35
WT11 = smd 1.7 x 0.8: 1 -6.7,2.5; 2 -6.7,1; 3 -6.7,-0.5; 4 -6.7,-2; 5 -6.7,-3.5; 6 -6.7,-5; 7 -6.7,-6.5; 8 -6.7,-8; 9 -6.7,-9.5; 10 -6.7,-11; 11 -6.7,-12.5; 12 -6.7,-14; 13 -6.7,-15.5; 14 -6.7,-17; 15 6.7,-17; 16 6.7,-15.5; 17 6.7,-14; 18 6.7,-12.5; 19 6.7,-11; 20 6.7,-9.5; 21 6.7,-8; 22 6.7,-6.5; 23 6.7,-5; 24 6.7,-3.5; 25 6.7,-2; 26 6.7,-0.5; 27 6.7,1; 28 6.7,2.5
SO16 = smd 0.66 x 2.032: 1 -4.445,-3.073; 2 -3.175,-3.073; 3 -1.905,-3.073; 4 -0.635,-3.073; 5 0.635,-3.073; 6 1.905,-3.073; 7 3.175,-3.073; 8 4.445,-3.073; 9 4.445,3.073; 10 3.175,3.073; 11 1.905,3.073; 12 0.635,3.073; 13 -0.635,3.073; 14 -1.905,3.073; 15 -3.175,3.073; 16 -4.445,3.073
SSOP28 = smd 0.4 x 1.5: 1 -4.225,-3.625; 2 -3.575,-3.625; 3 -2.925,-3.625; 4 -2.275,-3.625; 5 -1.625,-3.625; 6 -0.975,-3.625; 7 -0.325,-3.625; 8 0.325,-3.625; 9 0.975,-3.625; 10 1.625,-3.625; 11 2.275,-3.625; 12 2.925,-3.625; 13 3.575,-3.625; 14 4.225,-3.625; 15 4.225,3.625; 16 3.575,3.625; 17 2.925,3.625; 18 2.275,3.625; 19 1.625,3.625; 20 0.975,3.625; 21 0.325,3.625; 22 -0.325,3.625; 23 -0.975,3.625; 24 -1.625,3.625; 25 -2.275,3.625; 26 -2.925,3.625; 27 -3.575,3.625; 28 -4.225,3.625
6410-03 = drill 1.016 long: 1 2.54,0; 2 0,0; 3 -2.54,0
6410-04 = drill 1.016 long: 1 3.81,0; 2 1.27,0; 3 -1.27,0; 4 -3.81,0
CHIP-LED0805 = smd 1.2 x 1.2: A 0,-1.05; C 0,1.05
HC49UP = smd 5.334 x 1.93: 1 -4.826,0; 2 4.826,0
R0805 = smd 1.3 x 1.5: 1 -0.95,0; 2 0.95,0
M0805 = smd 1.3 x 1.6: 1 -0.95,0; 2 0.95,0
B3F-10XX = drill 1.016 long: 1 -3.251,2.261; 2 3.251,2.261; 3 -3.251,-2.261; 4 3.251,-2.261
SJ_2 = smd 1.168 x 1.6: 1 -1.524,0; 2 0,0; 3 1.524,0
MA04-2 = drill 1.016 octagon: 1 -3.81,-1.27; 2 -3.81,1.27; 3 -1.27,-1.27; 4 -1.27,1.27; 5 1.27,-1.27; 6 1.27,1.27; 7 3.81,-1.27; 8 3.81,1.27
W237-132 = drill 1.194 long: 1 -2.54,-0.635; 2 2.54,-0.635

### Placement (x,y rotation side)
C1  108,49.4 270 top
C2  111,49.4 270 bottom
C3  92,50.6 270 top
C4  102,50.3 270 top
C5  105.5,64.5 270 top
C6  110,66 270 bottom
C7  97,18 180 top
C8  103,13.5 180 top
C9  45.3,43.6 90 bottom
C10  50.6,38.5 0 bottom
C11  50.5,49.2 180 bottom
C12  56.5,44.5 90 bottom
C13  67.2,42.2 90 top
C14  67.2,49.9 270 top
C15  11.5,18 270 top
C16  33.1,11.5 270 bottom
C17  23.7,18.2 0 bottom
C18  26,24 0 bottom
C19  21.5,10.5 180 bottom
C20  41,10 270 top
C21  59.1,11.5 270 bottom
C22  49.7,18.2 0 bottom
C23  52,24 0 bottom
C24  47.5,10.5 180 bottom
C25  67,10 270 top
C26  85.1,11.5 270 bottom
C27  75.7,18.2 0 bottom
C28  78,24 0 bottom
C29  73.5,10.5 180 bottom
C30  26.7,56.4 270 top
C31  26.7,60 270 top
C32  21,53.6 180 top
C33  26.7,63.4 270 top
C34  17.7,53.6 0 top
C35  59.5,60 270 top
C36  45,62.1 180 top
CN1  5,32 270 top
D1  38.5,2.5 0 top
D2  17,8 270 top
D3  64.5,2.5 0 top
D4  41,22.5 90 top
D5  90.49,2.48 0 top
D6  67,22.5 90 top
F1  106,55.9 180 top
F2  115,71.2 180 top
IC1  95.5,51.9 90 top
IC2  51,44 0 top
IC3  81,52.5 180 top
IC4  28,22 0 top
IC5  54,22 0 top
IC6  80,22 0 top
IC7  10.7,78.7 270 bottom
IC8  21,60 90 top
IC9  53,62 270 top
J1  93,40.2 90 top
J2  101,40.2 90 top
J3  109,40.2 90 top
J4  117,40.2 90 top
J5  116,82 0 top
J6  101,30.2 90 top
J7  109,30.2 90 top
J8  117,30.2 90 top
J9  66,61.5 90 top
J10  74,61.5 90 top
J11  82,61.5 90 top
J12  5,54 90 top
J13  5,64 90 top
J26  36,89.4 0 top
J27  46,89.4 0 top
J28  56,89.4 0 top
J29  66,89.4 0 top
J30  76,89.4 0 top
J31  86,89.4 0 top
J32  96,89.4 0 top
J33  106,89.4 0 top
J34  36,81.2 0 top
J35  46,81.2 0 top
J36  56,81.2 0 top
J37  66,81.2 0 top
J38  76,81.2 0 top
J39  86,81.2 0 top
J40  96,81.2 0 top
J41  106,81.2 0 top
LED1  94.2,60.5 90 top
LED2  87.5,52.7 180 top
LED3  113.5,77.2 90 top
LED4  94,10.5 180 top
LED5  4.5,44 0 top
Q1  63,46 90 top
R1  116,46.4 180 bottom
R2  90,60.5 0 top
R3  102.5,49.3 180 bottom
R4  87.5,48.7 90 top
R5  110,61.7 270 bottom
R6  111.7,74.9 0 top
R7  94,6.5 90 top
R8  49.5,55 0 top
R9  53.5,55 180 top
R10  9,30.4 270 top
R11  9,26.4 270 top
R12  35,37.5 180 top
R13  7,44 90 top
R14  112.5,77 270 bottom
R15  94,27.5 180 top
R16  104.5,24.5 180 top
R17  112.5,24.5 180 top
R18  32,26 180 top
R19  25.5,10.5 180 bottom
R20  58,26 180 top
R21  51.5,10.5 180 bottom
R22  84,26 180 top
R23  77.5,10.5 180 bottom
R24  31,88 270 bottom
R25  41,88 270 bottom
R26  51,88 270 bottom
R27  61,88 270 bottom
R28  71,88.01 270 bottom
R29  81,88 270 bottom
R30  91,88 270 bottom
R31  101,88 270 bottom
R32  33.5,75.9 270 top
R33  43.5,75.9 270 top
R34  53.5,75.9 270 top
R35  63.5,75.9 270 top
R36  73.5,75.9 270 top
R37  83.5,75.9 270 top
R38  93.5,75.9 270 top
R39  103.5,75.9 270 top
R40  45,60 180 top
S1  35,43 180 top
SJ1  87,31.2 90 top
SJ2  91,31.2 90 top
SJ3  95,31.2 90 top
SJ4  35,85.3 0 bottom
SJ5  45,85.3 0 bottom
SJ6  55,85.3 0 bottom
SJ7  65,85.3 0 bottom
SJ8  75,85.3 0 bottom
SJ9  85,85.3 0 bottom
SJ10  95,85.3 0 bottom
SJ11  105,85.3 0 bottom
SJ12  37,75.2 270 top
SJ13  47,75.2 270 top
SJ14  57,75.2 270 top
SJ15  67,75.2 270 top
SJ16  77,75.2 270 top
SJ17  87,75.2 270 top
SJ18  97,75.2 270 top
SJ19  107,75.2 270 top
SV1  18,43 0 top
U$1  [LOGO_ARC_28MM]  17.2,77.8 0 top
U$2  [LOGO_ARC_28MM]  22.5,62.3 0 bottom
U$3  [LOGO_IEEE_22MM]  75.9,36.7 0 top
U$4  [LOGO_IEEE_22MM]  75.9,36.7 0 bottom
X1  116.5,53 90 top
X2  116.5,63.2 90 top
X3  103,7 0 top
X4  26,7 0 top
X5  52,7 0 top
X6  78,7 0 top

### Tracks (layer width: path | path; a pad name or v marks a point on that pad's centre or on a via)
0V  (via drill 0.3)
  other vias: 11.5,13.5 11.5,9.5 11.5,5.5 14.5,7.5 14.5,3.5 11.5,1.5 19.5,1.5 19.5,5.5 23.5,1.5 27.5,1.5 25.5,4.5 37.5,1.5 37.5,5.5 33.5,5.5 31.5,7.5 35.5,7.5 30.5,12.5 28.5,12.5 35.5,12.5 38.5,12.5 38.5,14.5 41.5,14.5 38.5,19.5 38.5,23.5 38.5,27.5 41.5,5.5 45.5,5.5 47.5,1.5 51.5,1.5 49.5,3.5 53.5,3.5 64.5,13.5 67.5,13.5 65.5,15.5 64.5,18.5 64.5,22.5 60.5,26.5 62.5,28.5 64.5,26.5 57.5,8.5 61.5,8.5 59.5,5.5 63.5,5.5 67.5,5.5 71.5,5.5 69.5,9.5 77.5,3.5 79.5,1.5 75.5,1.5 83.5,8.5 87.5,8.5 85.5,5.5 89.5,5.5 96.5,5.5 96.5,9.5 100.5,1.5 104.5,1.5 102.5,3.5 104.5,18.5 107.5,15.5 108.5,11.5 108.5,7.5 87.5,25.5 89.5,23.5 91.5,21.5 91.5,18.5 91.5,15.5 90.5,13.5 43.5,23.5 43.5,27.5
  pour Bottom (isolate 0.305, no thermals): 110,0 110,16 105,21 93,21 86.5,27.5 84.42,27.5 84.4,19 83.4,18 72,18 71,19 71,27.5 68.5,30 60.4,30 58.4,28 58.4,19 57.4,18 46,18 45,19 45,27.5 42.5,30 34.38,30 32.38,28.02 32.41,18.99 31.41,18 19,18 15,22 10.27,22 9,20.73 9,0
  pour Top (isolate 0.305, no thermals): 110,0 110,16 105,21 93,21 86.5,27.5 84.42,27.5 84.4,19 83.4,18 72,18 71,19 71,27.5 68.5,30 60.4,30 58.4,28 58.4,19 57.4,18 46,18 45,19 45,27.5 42.5,30 34.38,30 32.38,28.02 32.41,18.99 31.41,18 19,18 15,22 10.27,22 9,20.73 9,0
+3V3  (via drill 0.3, 0.5)
  Top 0.305: v50.2,48.4 IC2.40 | v51,39.6 IC2.17 | IC2.28 55.6,44 v55.3,43.7
  Top 0.406: C32.2 C34.2 18.55,54.93 IC8.16 | CN1.2 4.56,34.54 2.7,36.4 2.7,41.15 LED5.A
  Top 0.61: LED2.A v85,51.25 | CN1.2 12.54,34.54 15.5,37.5 R12.2 34.05,38.45 v34.6,39 | v40.1,52 21.1,52 20.15,52.95 C32.2
  Top 0.813: C3.+ LED2.A
  Top 1.27: C3.+ 93.85,51.9 IC1.2 101.35,51.9 C4.1
  Bottom 0.305: C10.1 51.45,39.15 v51,39.6
  Bottom 0.406: SV1.2 11,41.08 11,40.1 5.44,34.54 CN1.2 | IC7.2 9.7,84.6 13.6,80.7 18.1,80.7 26.2,72.6 IC7.16 | C12.1 56.45,43.7
  Bottom 0.61: 50.2,43.7 v55.3,43.7 56.45,43.7 | 50.2,43.7 v50.2,48.4 50.2,48.65 C11.1 46.85,52 v40.1,52 26.2,65.9 IC7.16 | v85,51.25 77.4,43.65 C12.1 | v34.6,39 40.1,39 41.6,40.5 48.7,40.5 | 48.7,40.5 50.1,40.5 v51,39.6 | 50.2,43.7 49.6,43.7 48.7,42.8 48.7,40.5
+5V  (via drill 0.3, 0.5)
  Top 0.305: C35.1 59.42,61.02 IC9.20 55.42,61.02 v51.5,57.1 51.5,55 | R8.2 51.5,55 | 51.5,55 R9.2 | v46,57.7 44.05,59.65 R40.2
  Top 0.61: SJ1.3 SJ2.3 SJ3.3 | J11.2 J10.2 J9.2 61.32,62.77 C35.1 | SJ12.3 41.3,73.68 | 41.3,73.68 SJ13.3 51.3,73.68 | 51.3,73.68 SJ14.3 61.3,73.68 | 61.3,73.68 SJ15.3 71.3,73.68 | 71.3,73.68 SJ16.3 81.3,73.68 | 81.3,73.68 SJ17.3 91.3,73.68 | 91.3,73.68 SJ18.3 101.3,73.68 | 101.3,73.68 SJ19.3 v108.63,73.68 | LED1.A 97,60.5 | v102.2,85.3 101.3,84.4 101.3,73.68 | v92.2,85.3 91.3,84.4 91.3,73.68 | v82.2,85.3 81.3,84.4 81.3,73.68 | v72.2,85.3 71.3,84.4 71.3,73.68 | v62.2,85.3 61.3,84.4 61.3,73.68 | v52.2,85.3 51.3,84.4 51.3,73.68 | v42.2,85.3 41.3,84.4 41.3,83.7 | 41.3,83.7 41.3,73.68 | v40,83.7 41.3,83.7
  Top 0.813: 88.15,57.4 IC3.5 v81.95,41.85 | 88.15,57.4 97,57.4 | 88.15,57.4 82.78,62.77 J11.2 | SJ1.3 v86.3,33.42
  Top 1.016: IC1.3 97,55.48 97,57.4 97,60.5 SJ18.3
  Bottom 0.305: v51.5,57.1 46.6,57.1 v46,57.7
  Bottom 0.61: v108.63,73.68 111,76.05 R14.2 | SJ11.3 v102.2,85.3 | SJ10.3 v92.2,85.3 | SJ9.3 v82.2,85.3 | SJ8.3 v72.2,85.3 | SJ7.3 v62.2,85.3 | SJ6.3 v52.2,85.3 | SJ5.3 v42.2,85.3 | SJ4.3 33.48,84.52 34.3,83.7 v40,83.7
  Bottom 0.813: v86.3,33.42 81.95,37.77 v81.95,41.85
  Bottom 1.27: C2.1 110.68,50.67 C1.+ 107.23,50.67 103.46,54.44 | IC1.3 103.46,54.44 | 103.46,54.44 F1.2
+12V
  Top 1.016: J27.2 46,86.7 | 46,86.7 J35.2 | J26.2 36,86.7 | 36,86.7 46,86.7 | J34.2 36,86.7 | J28.2 56,86.7 | 56,86.7 46,86.7 | J29.2 66,86.7 | 66,86.7 56,86.7 | J30.2 76,86.7 | 76,86.7 66,86.7 | J31.2 86,86.7 | 86,86.7 76,86.7 | J32.2 96,86.7 | 96,86.7 86,86.7 | J33.2 106,86.7 | 106,86.7 96,86.7 | J41.2 106,84.2 | 106,84.2 106,86.7 | J40.2 96,86.7 | J39.2 86,86.7 | J36.2 56,86.7 | J37.2 66,86.7 | J38.2 76,86.7 | 106,84.2 109.1,84.2 111.5,81.8 111.5,80.7 114.55,77.65 LED3.A 114.55,73.29 F2.2
  Top 1.27: J6.2 J7.2 112.4,30.2 | 112.4,30.2 J8.2 118,30.2 119.8,32 119.8,43.6 112.46,50.94 F2.2 | 112.46,30.26 112.4,30.2
+24V
  Top 1.27: X3.2 105.54,12.96 105.1,13.4 | 105.1,13.4 100.5,18 C7.+ 94,12.46 LED4.A 93.77,11.78 69.5,11.78 | C8.1 104.05,13.4 105.1,13.4 | 69.5,11.78 C25.+ 43.5,11.78 | IC6.2 69.5,17.03 69.5,11.78 | 43.5,11.78 C20.+ 39.12,9.9 16.6,9.9 14.9,11.6 14.9,19.6 | IC5.2 43.5,17.03 43.5,11.78 | 14.9,19.6 14.9,19.78 C15.+ | IC4.2 16.03,20.73 14.9,19.6
BT_RST  (via drill 0.3)
  Top 0.305: IC2.35 54.2,48.9 53,47.7 v49.1,47.7
  Bottom 0.305: v49.1,47.7 46,50.8 39.9,50.8 24.7,66 IC7.17
ENC_1_CHA
  Top 0.305: IC2.38 51.8,51.2 53.1,52.5 57.1,52.5 64.83,60.23 J9.3
ENC_1_CHB
  Top 0.305: IC2.37 52.6,51 53.4,51.8 57.4,51.8 63.29,57.69 J9.4
ENC_2_CHA
  Top 0.305: IC2.36 53.4,50.8 53.7,51.1 57.7,51.1 62.6,56 69,56 73.23,60.23 J10.3
ENC_2_CHB
  Top 0.305: J10.4 71.61,55.3 62.9,55.3 56.8,49.2 IC2.33
ENC_3  (via drill 0.3)
  Top 0.305: IC2.9 49.9,41.6 v53.5,45.2 | IC3.4 v78.45,49.6
  Bottom 0.305: v53.5,45.2 57.9,49.6 v78.45,49.6
FROM_TX_RS232_M
  Top 0.406: IC8.13 12.16,59.37 6.8,54 J12.2
GND  (via drill 0.3)
  other vias: 4,81 8,81 4,76 8,76 12,76 16,76 29,76 29,81 25,81 28,69 30,69 34,69 36,69 37.5,66.5 39.5,64.5 41.5,62.5 47.5,62.5 44.5,64.5 39.5,55.5 41.5,55.5 41.5,53.5 43.5,53.5 20.5,56.5 20.5,55.5 53.5,57.5 54.5,57.5 59.5,57.5 51.5,52.5 57.5,55.5 50.5,51.5 47.5,45 48.5,45 28.5,45.5 26.5,45.5 24.5,45.5 49.5,39.6 48.5,39.6 4,69.5 8,69.5 4,59 8.5,59 8.5,61.5 13,61.5 4,47.5 8.5,47.5 13,47.5 8.5,51.5 13,51.5 13,55.5 17.5,51.5 17.5,47.5 42.5,48.5 38.5,48.5 34.5,48.5 30.5,48.5 26.5,48.5 38.5,37.5 40.5,37.5 15.5,27.5 19.5,27.5 23.5,27.5 27.5,27.5 17.5,30.5 21.5,30.5 25.5,30.5 29.5,30.5 39.5,31.5 43.5,31.5 45.5,28.5 49.5,28.5 47.5,26.5 51.5,26.5 53.5,28.5 54.5,27.5 53.5,26.5 54.5,25.5 74.5,32.5 77,32.5 79.5,32.5 56.5,24.5 57.5,24.5 72,30 74,28 76,26 78,30 79.5,28 80.5,30 82,28 55.5,53.5 22.5,48.5 64.6,38.5 65.4,38.5 53,40 52,41 57,36 58.5,34.5 55.5,35.5 57,34 53.5,41.5 55.2,44.8 58.4,44.6 61.3,40 61.3,41 57,29.5 58.5,29.5 1.5,34.5 1.5,30.5 1.5,26.5 70.5,39.5 70.5,41.5 74.5,41.5 78.5,41.5 78.5,39.5 74.5,39.5 69,47.5 69,45.5 73,47.5 77,47.5 77,45.5 73,45.5 75.5,51.5 71.5,51.5 83.5,40.5 83.5,44.5 84.5,48.5 90.5,47.5 94.5,47.5 94.5,50.5 90.5,50.5
  pour Bottom (isolate 0.305, rank 2, no thermals): 0,24 0,86.5 29,86.5 30,85.5 30,73 32.5,70.5 58,70.5 60.5,68 60.5,57.5 65.5,52.5 102.5,52.5 103.5,51.5 103.5,48 101,45.5 84.5,45.5 84.5,24.8 81.5,21.8 81.5,19.5 80.5,18.5 79.5,18.5 78.5,19.5 78.5,22.73 77.23,24 56.77,24 55.5,22.73 55.5,19.5 54.5,18.5 53.5,18.5 52.5,19.5 52.5,22.73 51.23,24 30.77,24 29.5,22.73 29.5,19.5 28.5,18.5 27.5,18.5 26.5,19.5 26.5,22.73 25.23,24
  pour Top (isolate 0.305, rank 2, no thermals): 0,24 0,86.5 29,86.5 30,85.5 30,73 32.5,70.5 58,70.5 60.5,68 60.5,57.5 65.5,52.5 102.5,52.5 103.5,51.5 103.5,48 101,45.5 84.5,45.5 84.5,24.8 81.5,21.8 81.5,19.5 80.5,18.5 79.5,18.5 78.5,19.5 78.5,22.73 77.23,24 56.77,24 55.5,22.73 55.5,19.5 54.5,18.5 53.5,18.5 52.5,19.5 52.5,22.73 51.23,24 30.77,24 29.5,22.73 29.5,19.5 28.5,18.5 27.5,18.5 26.5,19.5 26.5,22.73 25.23,24
GND_SERVO_5V
  Bottom 1.27: J1.1 J2.1 J3.1 J4.1 116.95,42.79 R1.2 116.95,50.27 X1.1
GND_SERVO_12V  (via drill 0.3)
  Bottom 1.27: X2.1 117.05,60.75 R5.2
  other vias: 120.5,79.5 120.5,75.5 120.5,71.5 120.5,67.5 120.5,63.5 120.5,59.5 120.5,83.5
  pour Bottom (isolate 0.305, no thermals): 122,86 122,58.3 112.5,58.3 112.5,86
  pour Top (isolate 0.305, no thermals): 122,86 122,58.3 112.5,58.3 112.5,86
GNDIO  (via drill 0.3)
  Bottom 1.27: C1.- 104.62,48.13 R3.2
  other vias: 35.5,93 39.5,93 45.5,93 49.5,93 55.5,93 59.5,93 65.5,93 69.5,93 75.5,93 79.5,93 85.5,93 89.5,93 95.5,93 99.5,93 105.5,93 109.5,93 38,85 39.5,85 48,85 49.5,85 58,85 59.5,85 68,85 69.5,85 78,85 79.5,85 88,85 89.5,85 98,85 99.5,85 108.5,85.5 110.5,85.5 40,77.5 40,75.5 50,77.5 50,75.5 60,77.5 59.5,76.5 70,77.5 70,76 80,77.5 80,75.5 90,77.5 90,75.5 100,77.5 100,75.5 81.5,70.5 85.5,70.5 90.5,70.5 94.5,70.5 110.5,79.5 105.4,77.7 63.5,67.5 71.5,67.5 67.5,67.5 75.5,67.5 79.5,67.5 83.5,67.5 87.5,67.5 91.5,67.5 89.5,65.5 87.5,63.5 93.5,62.5 95.5,62.5 95.5,64.5 77,58.5 77,60.5 79,61.5 79,59.5 77.5,54.5 75.5,54.5 73.5,54.5 88.5,55.5 94.5,55.5 94.5,53.5 107.5,71.5 103.5,71.5 105.5,69.5 101.5,69.5 99.5,65.5 102.5,63.5 99.5,61.5 102.5,59.5 108.5,63.5 108.5,59.5 107.5,53.5 110.5,53.5 97.5,29 97.5,31 97.5,33 85.4,30.4 85.5,32.5 89,34 93,34 105,32 105,28.5 113,28.5 113,32 113,33.5 117,34.5 86.5,43.5 88.5,41.5 86.5,39.5 96.5,38.5 104.5,38.5 112.5,38.5 112.5,36 110.5,36 104.5,36.5 113.5,44.5 111.5,47.5 109.5,44.5 105.5,44.5 104.5,47.5 91.5,44.5 95.5,44.5 99.5,44.5
  pour Bottom (isolate 0.305, rank 3, no thermals): 30,25 122,25 122,86 111,86 111,94 30,94
  pour Top (isolate 0.305, rank 3, no thermals): 30,25 122,25 122,86 111,86 111,94 30,94
GP0_0  (via drill 0.3)
  Top 0.305: v44.3,66.9 51.1,66.9 52.6,65.4 52.6,63.4 54.33,61.67 IC9.21
  Bottom 0.305: v44.3,66.9 31,80.2 R24.2 33.75,87.05 35,85.8 SJ4.2
GP0_1  (via drill 0.3)
  Top 0.305: IC9.22 54.67,62.33 53.3,63.7 53.3,65.7 51.4,67.6 44.6,67.6 v44.3,67.9
  Bottom 0.305: v44.3,67.9 41,71.2 R25.2 43.75,87.05 45,85.8 SJ5.2
GP0_2  (via drill 0.3)
  Top 0.305: IC9.23 55.02,62.98 54,64 v54,69
  Bottom 0.305: v54,69 54,77.5 51,80.5 R26.2 53.75,87.05 55,85.8 SJ6.2
GP0_3  (via drill 0.3)
  Top 0.305: IC9.24 55.38,63.62 54.7,64.3 v54.7,68.3
  Bottom 0.305: v54.7,68.3 54.7,69.7 61,76 R27.2 63.75,87.05 65,85.8 SJ7.2
GP0_4  (via drill 0.3)
  Top 0.305: IC9.25 55.73,64.28 55.4,64.6 v55.4,69
  Bottom 0.305: v55.4,69 62.1,75.7 65.7,75.7 71,81 R28.2 73.74,87.06 75,85.8 SJ8.2
GP0_5  (via drill 0.3)
  Top 0.305: IC9.26 58.02,64.92 64.1,71 v71.1,71
  Bottom 0.305: v71.1,71 81,80.9 R29.2 83.75,87.05 85,85.8 SJ9.2
GP0_6  (via drill 0.3)
  Top 0.305: IC9.27 57.58,65.58 63.7,71.7 v81.8,71.7
  Bottom 0.305: v81.8,71.7 91,80.9 R30.2 93.75,87.05 95,85.8 SJ10.2
GP0_7  (via drill 0.3)
  Top 0.305: IC9.28 62.8,72.4 v92.5,72.4
  Bottom 0.305: v92.5,72.4 101,80.9 R31.2 103.85,87.05 105,85.9 SJ11.2
GP1_0
  Top 0.406: IC9.2 42.33,65.58 35.3,72.6 35.3,75.2
  Top 0.61: SJ12.2 35.3,75.2 33.75,75.2 R32.2
GP1_1  (via drill 0.3)
  Top 0.305: IC9.3 47.73,64.92 v47.5,64.7
  Top 0.61: R33.2 43.75,75.2 v45,75.2 SJ13.2
  Bottom 0.305: v47.5,64.7 45,67.2 v45,75.2
GP1_2  (via drill 0.3)
  Top 0.305: IC9.4 50.58,64.28 v50.9,64.6 | v52.2,74.9 53.45,74.9 R34.2
  Top 0.61: SJ14.2 53.75,75.2 R34.2
  Bottom 0.305: v50.9,64.6 50.9,73.6 v52.2,74.9
GP1_3  (via drill 0.3)
  Top 0.305: v62.4,74.9 62.45,74.95 R35.2 | v51,63.6 49.4,63.6 IC9.5
  Top 0.61: SJ15.2 63.75,75.2 R35.2
  Bottom 0.305: v62.4,74.9 51.12,63.62 51.02,63.62 v51,63.6
GP1_4  (via drill 0.3)
  Top 0.305: R36.2 72.45,74.95 v72.4,74.9 | IC9.7 51.02,62.33 v51.1,62.4
  Top 0.61: SJ16.2 73.75,75.2 R36.2
  Bottom 0.305: v72.4,74.9 63.6,74.9 v51.1,62.4
GP1_5  (via drill 0.3)
  Top 0.305: IC9.11 50.52,59.73 v50.8,60 | v82.4,74.9 82.45,74.95 R37.2
  Top 0.61: SJ17.2 83.75,75.2 R37.2
  Bottom 0.305: v50.8,60 60.9,70.1 77.6,70.1 v82.4,74.9
GP1_6  (via drill 0.3)
  Top 0.305: IC9.12 50.98,59.08 v51,59.1 | v92.4,74.9 92.45,74.95 R38.2
  Top 0.61: SJ18.2 93.75,75.2 R38.2
  Bottom 0.305: v51,59.1 61.3,69.4 86.9,69.4 v92.4,74.9
GP1_7  (via drill 0.3)
  Top 0.305: IC9.13 51.52,58.42 v51.6,58.5 | v102.3,74.9 102.35,74.95 R39.2
  Top 0.61: SJ19.2 103.75,75.2 R39.2
  Bottom 0.305: v51.6,58.5 61.8,68.7 96.1,68.7 v102.3,74.9
I2C_SCL_(5V)
  Top 0.305: 48.55,56.95 R8.1 48.6,54.95 IC2.42 | 48.55,56.95 IC9.14 | J13.2 11.9,64 13.7,65.8 29.1,65.8 37.95,56.95 48.55,56.95
I2C_SDA_(5V)  (via drill 0.3)
  Top 0.305: IC2.41 v49.4,52.8 50.3,53.7 53.4,53.7 54.45,54.75 R9.1 56.62,57.17 IC9.15 | J13.1 34.26,66.54 v42.8,58
  Bottom 0.305: v49.4,52.8 44.2,58 v42.8,58
MISO
  Top 0.305: SV1.7 23.78,43.7 39.7,43.7 42.4,46.4 IC2.3
MOSI
  Top 0.305: SV1.6 22.2,47.2 IC2.2
MOT_1_PWM  (via drill 0.3)
  Top 0.305: IC2.14 48.6,36.7 48.1,36.2 v40,36.2
  Bottom 0.305: IC4.11 37,16.15 37,31.2 40,34.2 v40,36.2
MOT_1_SIGN1  (via drill 0.3)
  Top 0.305: IC2.19 52.6,37.2 50.2,34.8 v37.8,34.8
  Bottom 0.305: IC4.5 28.85,18.2 31.6,18.2 33.2,19.8 33.2,30.2 v37.8,34.8
MOT_1_SIGN2  (via drill 0.3)
  Top 0.305: IC2.20 53.4,37 50.5,34.1 v38.5,34.1
  Bottom 0.305: IC4.7 30.15,15.65 32.7,18.2 34.9,18.2 36.2,19.5 36.2,31.8 v38.5,34.1
MOT_2_PWM  (via drill 0.3)
  Top 0.305: IC2.10 44.4,40.8 43.8,40.2 v43.8,39.6
  Bottom 0.305: v43.8,39.6 42.4,38.2 42.4,37.3 49.2,30.5 53.8,30.5 62.5,21.8 IC5.11
MOT_2_SIGN1  (via drill 0.3)
  Top 0.305: v47.8,37 IC2.13 | v52.1,32.7 52.3,32.5 IC5.5
  Bottom 0.305: v47.8,37 v52.1,32.7
MOT_2_SIGN2  (via drill 0.3)
  Top 0.305: v54,34 55.7,32.3 IC5.7 | v49.4,36.7 IC2.15
  Bottom 0.305: v49.4,36.7 52.1,34 v54,34
MOT_3_PWM  (via drill 0.3)
  Top 0.305: IC2.8 v49.6,42.4 | v72.7,32.4 81.1,24 86.2,24 88.5,21.7 IC6.11
  Bottom 0.305: v49.6,42.4 62.7,42.4 v72.7,32.4
MOT_3_SIGN1  (via drill 0.3)
  Top 0.305: IC2.11 v45.2,38.5 | v68.5,31.9 78.3,22.1 IC6.5
  Bottom 0.305: v68.5,31.9 49.9,31.9 45.2,36.6 v45.2,38.5
MOT_3_SIGN2  (via drill 0.3)
  Top 0.305: IC2.12 47,39.3 v47.3,39.6 | v71.1,32.6 81.7,22 IC6.7
  Bottom 0.305: v47.3,39.6 47.3,39.2 49,37.5 51.6,37.5 56.5,32.6 v71.1,32.6
N$1
  Bottom 1.27: C16.1 IC4.9
N$2
  Bottom 0.61: R24.1 31.45,89.4 J26.3
N$3
  Top 0.61: R15.1 100.84,27.5 J6.3
N$4
  Bottom 0.61: R28.1 71.44,89.4 J30.3
N$5
  Bottom 0.61: R25.1 41.45,89.4 J27.3
N$6
  Bottom 0.61: R29.1 81.45,89.4 J31.3
N$7
  Top 0.61: J34.3 33.46,76.89 R32.1
N$8
  Top 0.406: R13.2 4.6,44.95 LED5.C
N$9
  Top 0.61: J38.3 73.46,76.89 R36.1
N$10
  Top 0.61: IC3.1 84.5,56.34 84.5,58.5 82.77,60.23 J11.3
N$11
  Top 0.61: IC3.2 81,56.69 J11.4
N$12
  Bottom 1.27: C18.1 29,24 31.4,21.6 IC4.8
N$13
  Top 0.61: J7.3 108.61,27.66 R16.1
N$14
  Bottom 1.27: IC4.4 24.65,20.68 C17.1
N$15
  Bottom 1.27: C19.2 R19.1
N$16
  Bottom 0.406: IC7.5 14.2,86.1 15,86.9 20.9,86.9 21.7,86.1 IC7.10
N$17
  Top 0.61: J35.3 43.46,76.89 R33.1
N$18
  Top 0.61: J39.3 83.46,76.89 R37.1
N$19
  Top 0.61: J40.3 93.46,76.89 R38.1
N$20
  Top 0.61: J36.3 53.46,76.89 R34.1
N$21
  Bottom 1.27: D1.C 32.41,2.5 X4.2 28.54,9.66 27.75,10.45 | C17.2 22.75,15.8 IC4.3 22.9,15.3 27.75,10.45 | R19.2 26.5,10.45 27.75,10.45
N$22
  Bottom 1.27: 19.5,13.1 IC4.1 19,16.15 19,22.2 20.8,24 C18.2 | 19.5,13.1 19.5,10.6 | 19.5,10.6 19.5,10.32 X4.1 | D2.C 19.48,13.08 19.5,13.1 | C19.1 20.45,10.6 19.5,10.6
N$23
  Top 0.61: J37.3 63.46,76.89 R35.1
N$24
  Top 0.61: J41.3 103.46,76.89 R39.1
N$25
  Bottom 0.61: R30.1 91.45,89.4 J32.3
N$26
  Bottom 0.61: R31.1 101.45,89.4 J33.3
N$27
  Top 0.406: IC8.1 C30.2
N$28
  Bottom 0.61: R27.1 61.45,89.4 J29.3
N$29
  Bottom 1.27: C21.1 IC5.9
N$30
  Top 0.406: C30.1 25.86,58.09 IC8.3
N$31
  Top 0.406: C31.2 26.48,59.37 IC8.4
N$32
  Top 0.406: C31.1 26.48,60.63 IC8.5
N$33
  Top 0.406: IC8.2 23.02,56.83 21.85,55.65 C32.1
N$34
  Top 0.406: C33.2 26.15,62.55 25.5,61.91 IC8.6
N$35
  Bottom 0.61: R26.1 51.45,89.4 J28.3
N$36
  Bottom 1.27: C26.1 IC6.9
N$37
  Bottom 1.27: C28.1 81,24 83.4,21.6 IC6.8
N$38
  Bottom 1.27: IC6.4 76.65,20.68 C27.1
N$39
  Bottom 1.27: C23.1 55,24 57.4,21.6 IC5.8
N$40
  Bottom 1.27: C29.2 R23.1
N$41
  Bottom 1.27: IC5.4 50.65,20.68 C22.1
N$42
  Bottom 1.27: C24.2 R21.1
N$43
  Bottom 1.27: D3.C 58.41,2.5 X5.2 54.54,9.56 53.75,10.35 | C22.2 48.75,15.8 IC5.3 48.9,15.2 53.75,10.35 | R21.2 52.6,10.35 53.75,10.35
N$44
  Bottom 1.27: X5.1 45.66,10.16 | 45.66,10.16 45.5,10.32 IC5.1 43.73,17.42 | C24.1 46.21,10.16 45.66,10.16 | 43.73,17.42 D4.C | C23.2 46.8,24 43.73,20.93 43.73,17.42
N$45
  Bottom 1.27: D5.C 84.42,2.48 X6.2 80.54,9.56 79.65,10.45 | C27.2 74.75,15.8 IC6.3 74.9,15.2 79.65,10.45 | R23.2 78.5,10.45 79.65,10.45
N$46
  Bottom 1.27: X6.1 71.71,10.11 | 71.71,10.11 71.5,10.32 IC6.1 69.73,17.42 | C29.1 72.16,10.11 71.71,10.11 | D6.C 69.73,17.42 | C28.2 72.7,24 69.73,21.03 69.73,17.42
N$47
  Top 0.305: IC2.31 58.57,46.4 Q1.2 67.18,50.83 C14.1
N$48
  Top 0.305: IC2.30 58.57,45.6 Q1.1 67.03,41.17 67.1,41.1 67.1,41.15 C13.1
N$49  (via drill 0.3)
  Top 0.305: v47,43.2 IC2.7
  Bottom 0.305: C9.+ 45.9,42.1 v47,43.2
N$50
  Top 0.61: R17.1 116.61,27.66 J8.3
N$63
  Top 0.305: IC9.9 45.95,61.02 | 45.95,61.02 C36.1 | R40.1 45.95,61.02
N$64
  Top 0.61: R2.2 LED1.C
N$65
  Top 0.406: R4.2 LED2.C
N$66
  Top 0.61: LED3.C 112.65,77 R6.2
N$67
  Top 0.61: LED4.C R7.2
PGEC
  Top 0.305: IC2.22 55,36.6 51.1,32.7 17.5,32.7 12.15,27.35 R11.1
  Top 0.406: R11.1 5.43,27.35 CN1.5
PGED
  Top 0.305: R10.2 13.15,29.45 17.1,33.4 50.8,33.4 54.2,36.8 IC2.21
  Top 0.406: R10.2 CN1.4
RF24_CE  (via drill 0.3)
  Top 0.305: IC2.34 55,48.7 52.6,46.3 47.5,46.3 v46.9,46.9
  Top 0.406: R13.1 9.95,40.1 15.1,40.1 SV1.3
  Bottom 0.305: SV1.3 18,43 18,44.9 20,46.9 v46.9,46.9
RST
  Top 0.305: R12.1 37.95,35.5 49.9,35.5 51.8,37.4 IC2.18
  Top 0.61: 35.95,40.74 S1.2 26.84,40.74 24.8,38.7 6.62,38.7 CN1.1 | 35.95,40.74 S1.1 | R12.1 35.95,40.74
SCK
  Top 0.305: SV1.5 20.8,40.2 22.8,40.2 25.5,42.9 40.2,42.9 42.9,45.6 IC2.4
SENSOR_1  (via drill 0.3)
  Top 0.305: SJ1.2 v85.9,31.2 | v43.1,37.6 43.1,43.6 44.3,44.8 IC2.5
  Top 0.406: SJ1.2 87.9,31.2 89.2,29.9 89.2,29 90.7,27.5 R15.2
  Bottom 0.305: v85.9,31.2 49.5,31.2 v43.1,37.6
SENSOR_2  (via drill 0.3)
  Top 0.305: IC2.23 56.8,38.8 61.4,34.2 80.4,34.2 86.1,28.5 v88.4,28.5 92.4,24.5 R16.2 | SJ2.2 v89.8,31.2
  Bottom 0.305: v89.8,31.2 88.4,29.8 v88.4,28.5
SENSOR_3  (via drill 0.3)
  Top 0.305: R17.2 110.35,23.3 92.4,23.3 v88.1,27.6 86,27.6 80.1,33.5 61.1,33.5 56.1,38.5 56.1,38.9 54.5,40.5 54.5,45.8 55.9,47.2 IC2.32 | v93.8,31.2 SJ3.2
  Bottom 0.305: v88.1,27.6 90.2,27.6 v93.8,31.2
SERVO_1_PWM
  Top 0.305: J1.3 61.94,37.66 60.3,39.3 60.3,41.1 58.2,43.2 IC2.27
SERVO_2_PWM
  Top 0.305: J2.3 99.64,36.3 62.3,36.3 59.6,39 59.6,40.8 58,42.4 IC2.26
SERVO_3_PWM
  Top 0.305: J3.3 106.94,35.6 62,35.6 58.9,38.7 58.9,40.5 57.8,41.6 IC2.25
SERVO_4_PWM
  Top 0.305: J4.3 114.24,34.9 61.7,34.9 58.2,38.4 58.2,40.2 57.6,40.8 IC2.24
SERVO_AX12_UART  (via drill 0.3)
  Top 0.305: IC2.1 47.4,48 48.4,47 v52.2,47
  Bottom 0.305: v52.2,47 61,55.8 84.8,55.8 106.95,77.95 R14.1
  Bottom 0.61: J5.3 112.5,81.04 R14.1
TO_RX_RS232_M
  Top 0.406: IC8.14 12.7,58.09 6.06,51.46 J12.3
UART_RX  (via drill 0.3)
  Top 0.305: IC2.44 v40.5,49.8
  Bottom 0.305: v40.5,49.8 29.3,49.8 11.2,67.9 IC7.26
UART_RX_BYPASS  (via drill 0.3)
  Top 0.406: IC8.12 19.73,60.63 v20.2,61.1
  Bottom 0.406: v20.2,61.1 IC7.20
UART_TX  (via drill 0.3)
  Top 0.305: IC2.43 47.8,51.6 v43.5,55.9
  Bottom 0.305: v43.5,55.9 31.9,67.5 31.9,70.2 20,82.1 17.8,82.1 15.7,84.2 IC7.6
UART_TX_BYPASS  (via drill 0.3)
  Top 0.406: IC8.11 19.5,61.91 v21.7,64.1
  Bottom 0.406: v21.7,64.1 IC7.19
VCC_SERVO_5V
  Bottom 1.27: F1.1 108.9,55.54 X1.2 120.4,52.27 120.4,42.4 118.2,40.2 J4.2 J3.2 J2.2 J1.2
VCC_SERVO_12V
  Bottom 1.27: C5.+ 105.59,66.95 C6.1 117.14,66.95 | 117.14,66.95 X2.2 | 117.14,66.95 117.14,70.8 F2.1 116,72.74 J5.2

### Text on the board
tPlace: mainboard_v03 | RESAJ / JBS
bPlace: mainboard_v03 | RESAJ / JBS